# EAGLE design CrackberryPi_1.0.6 (EAGLE 7.2.0)
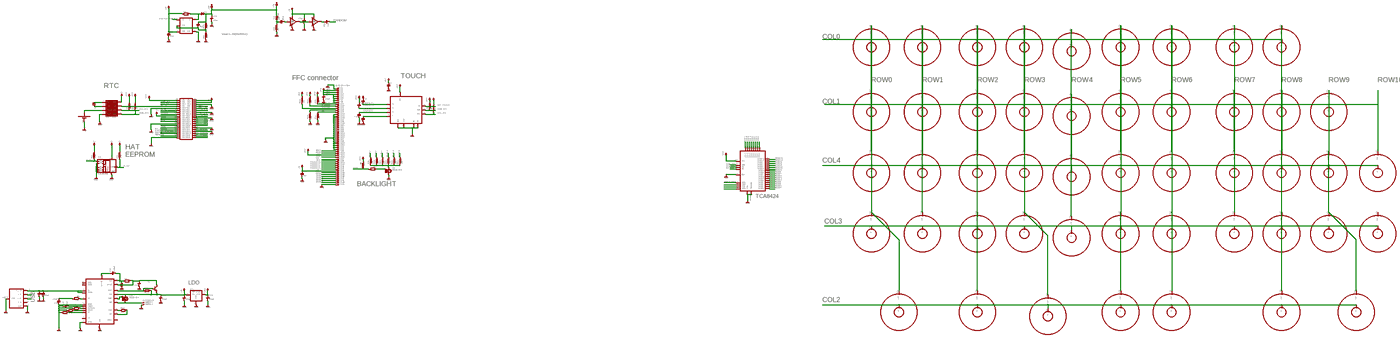
[diagram p0: schematic, sheet 1, overview]
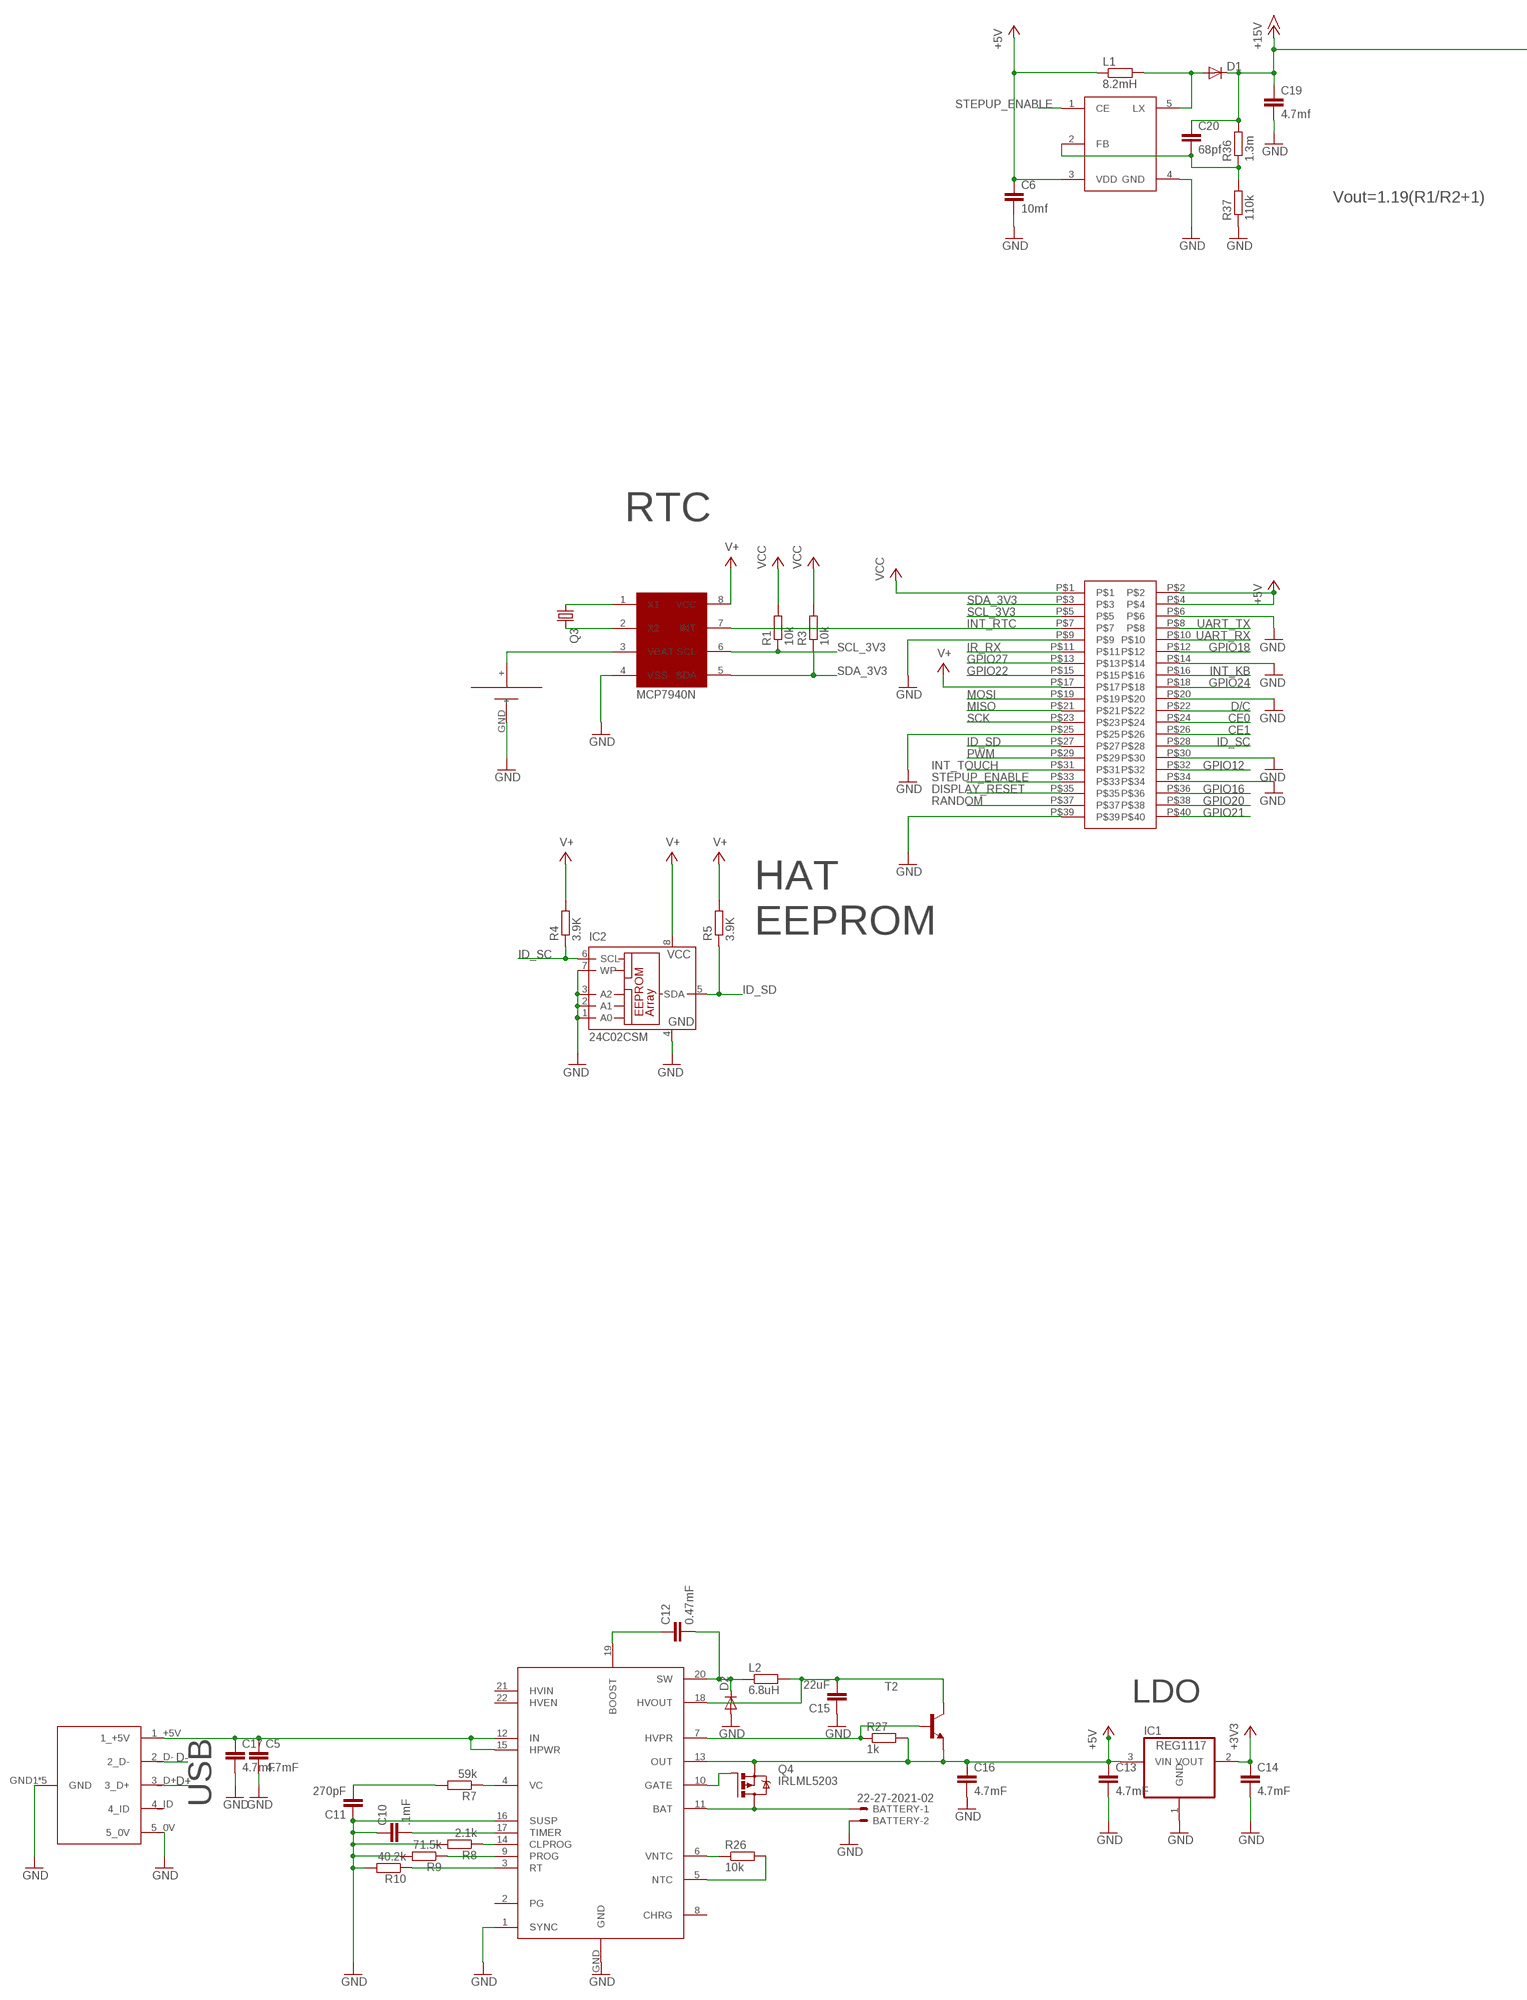
[diagram p1: schematic, sheet 1, part 1 of 4]
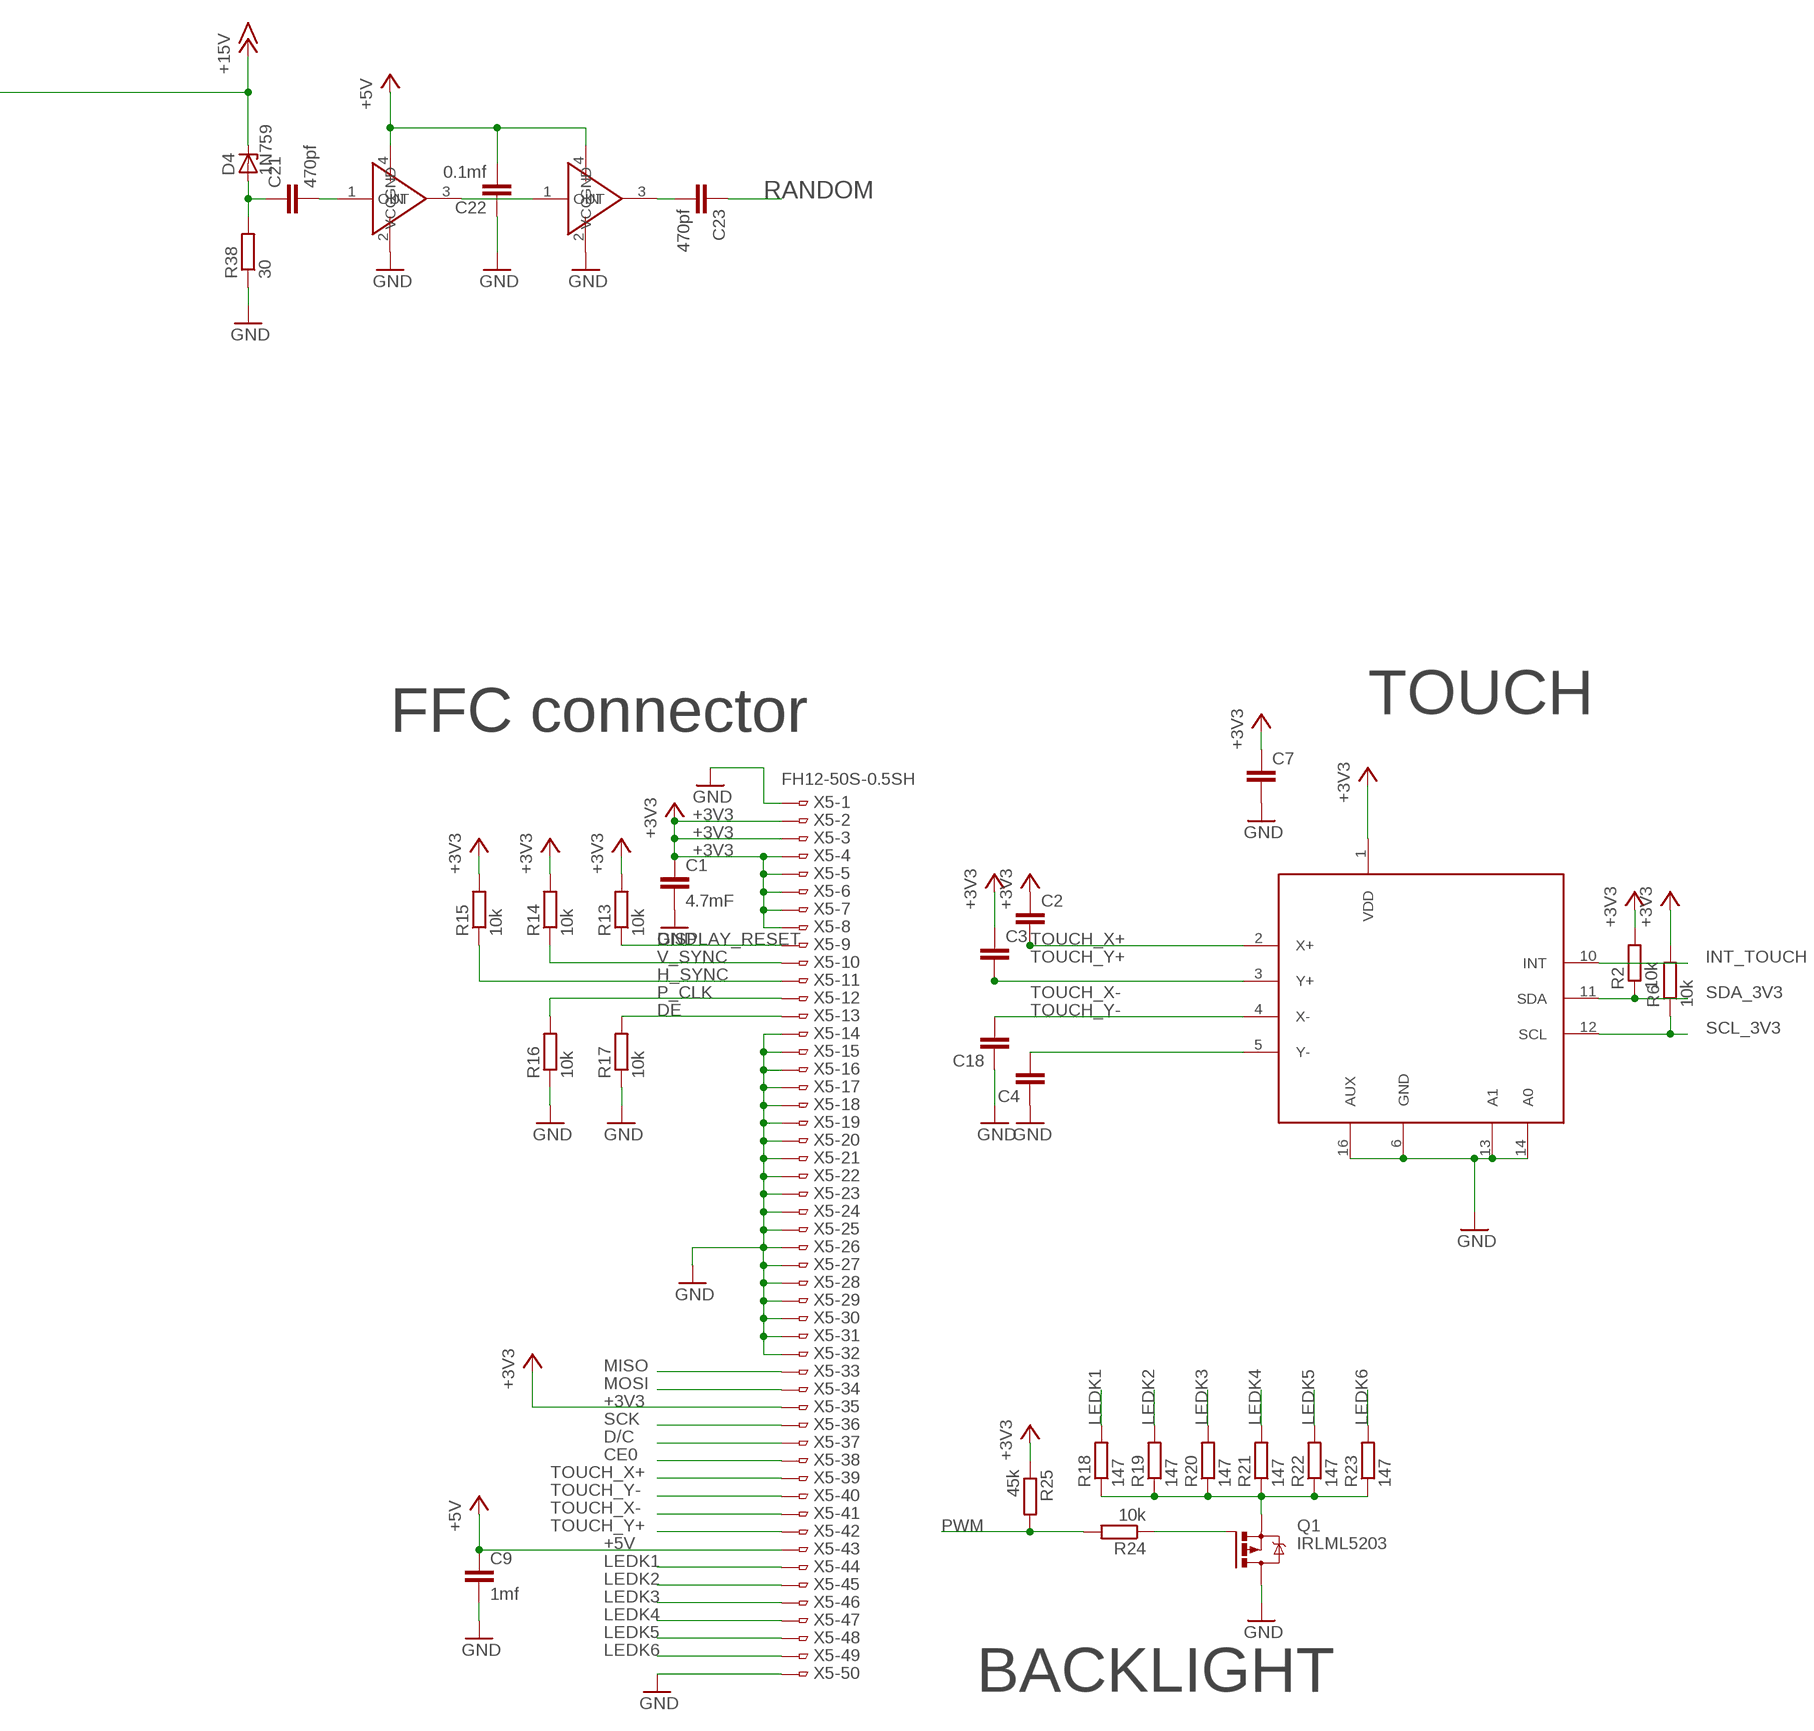
[diagram p2: schematic, sheet 1, part 2 of 4]
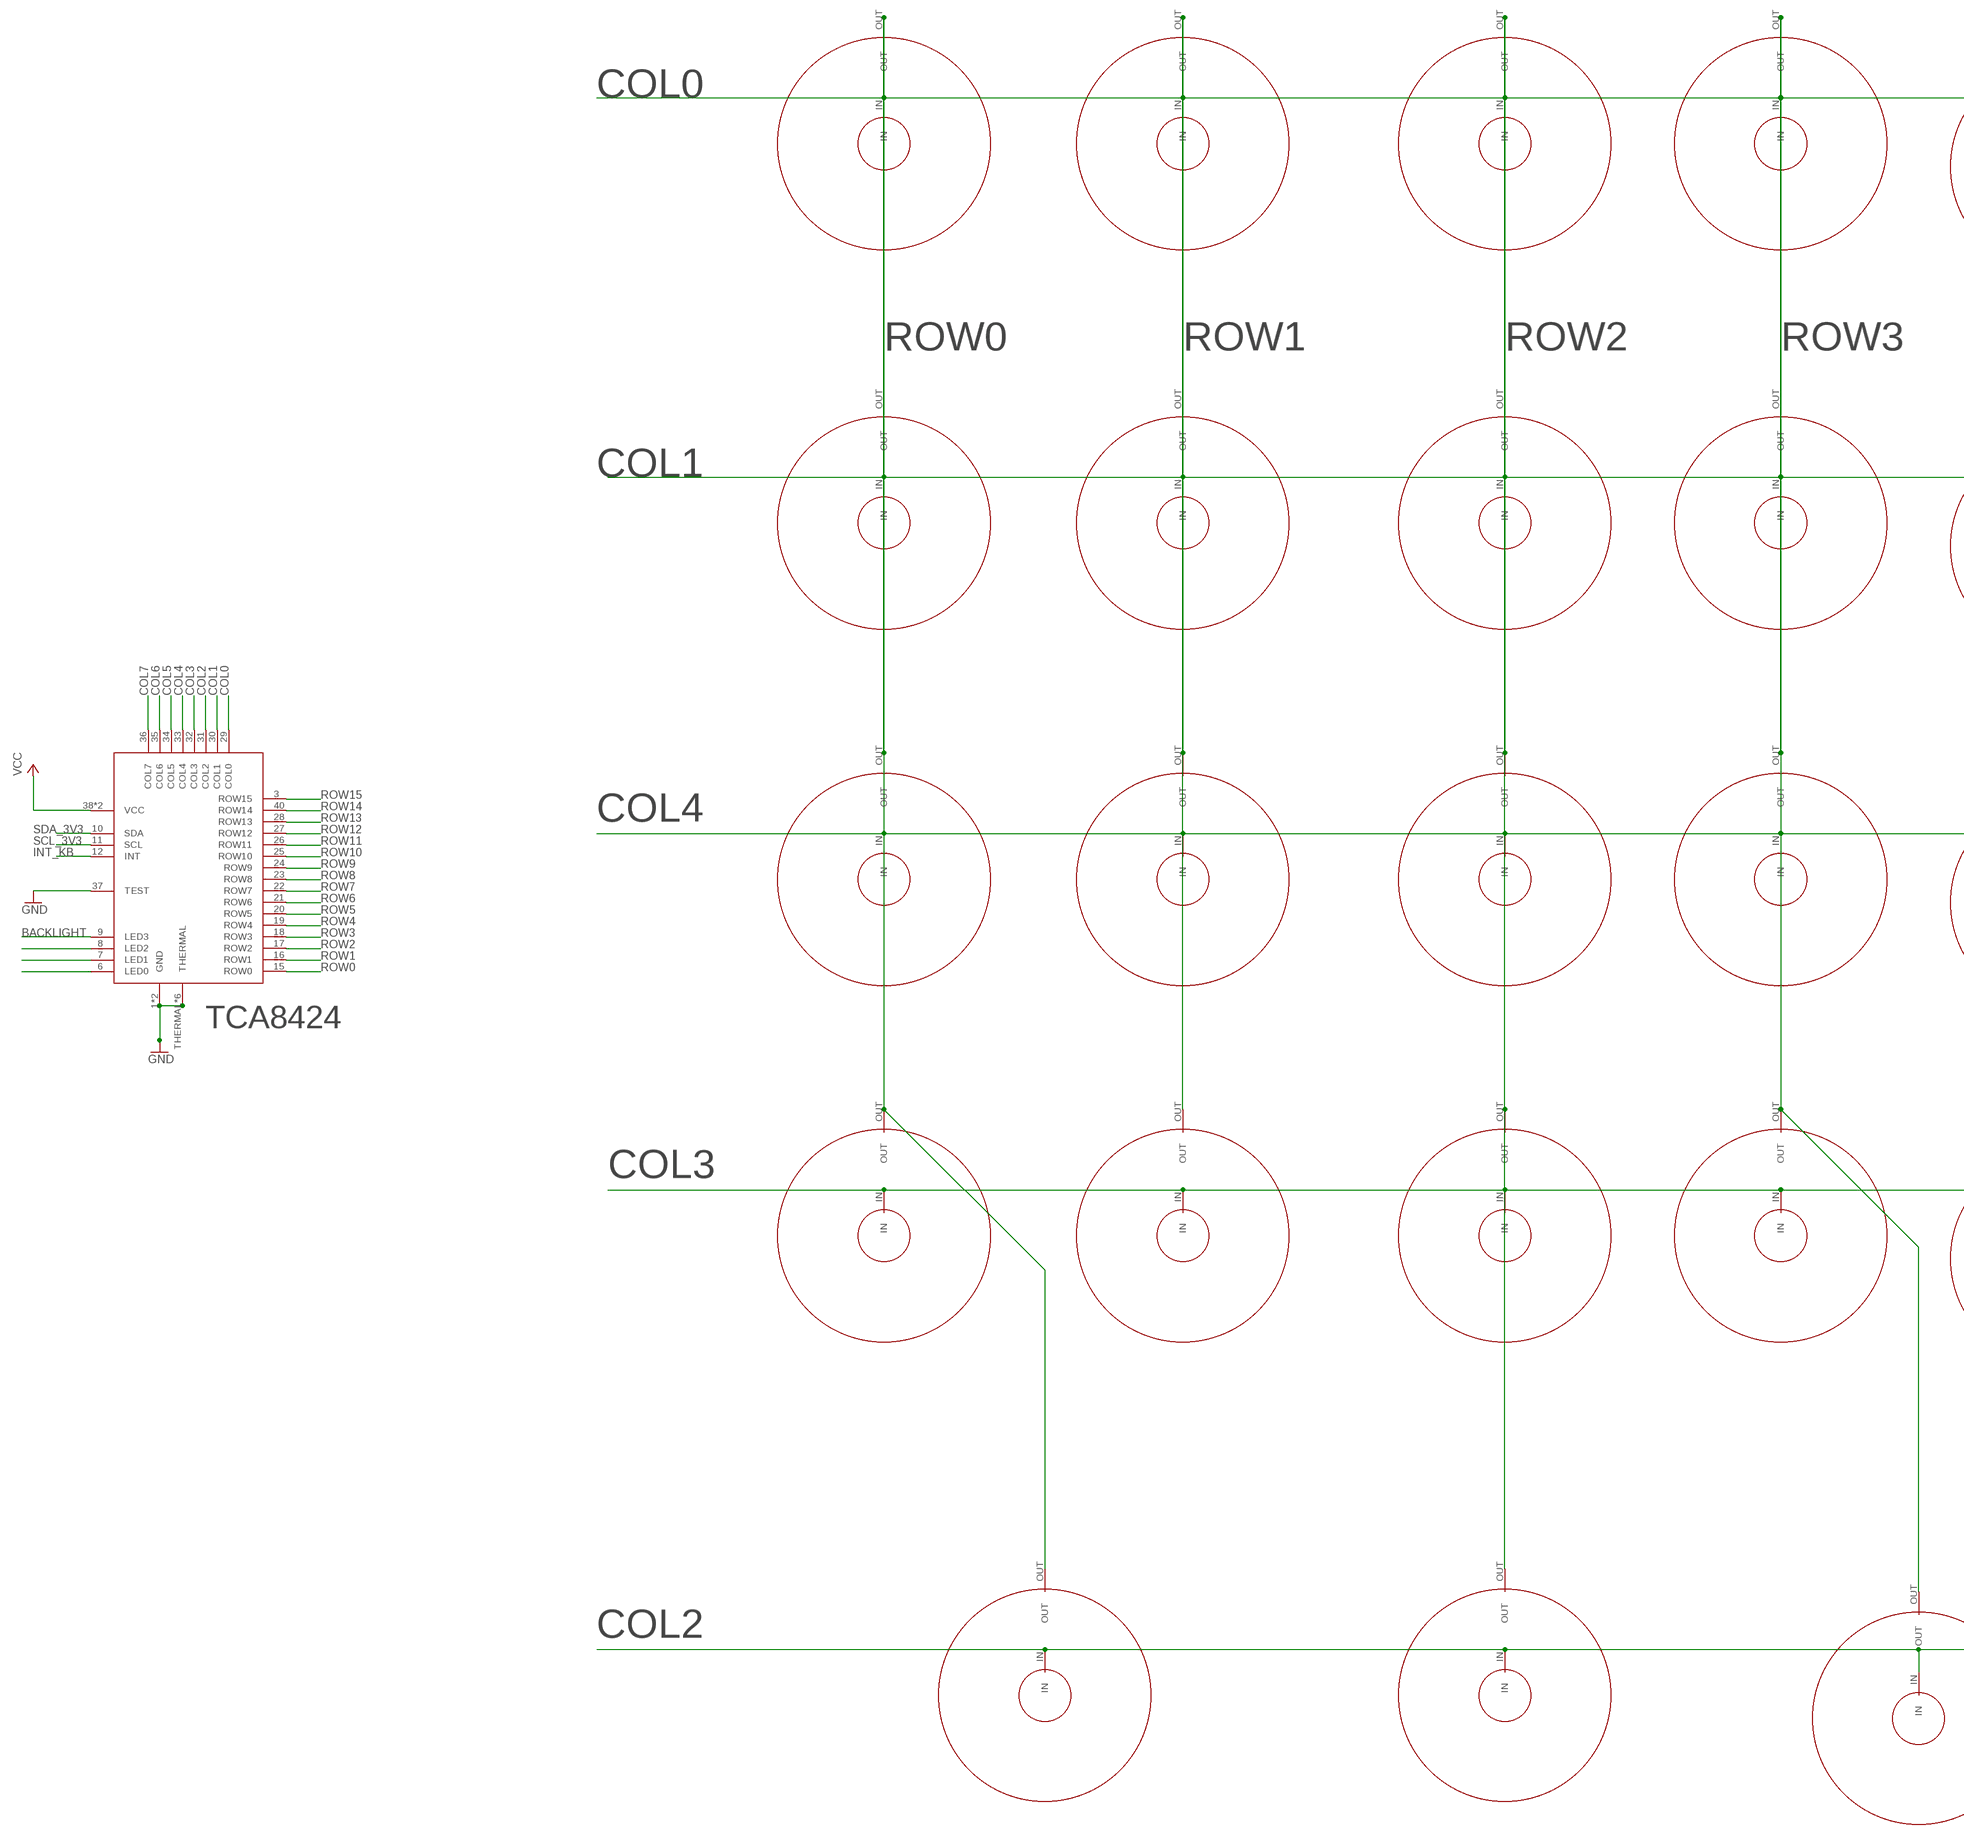
[diagram p3: schematic, sheet 1, part 3 of 4]
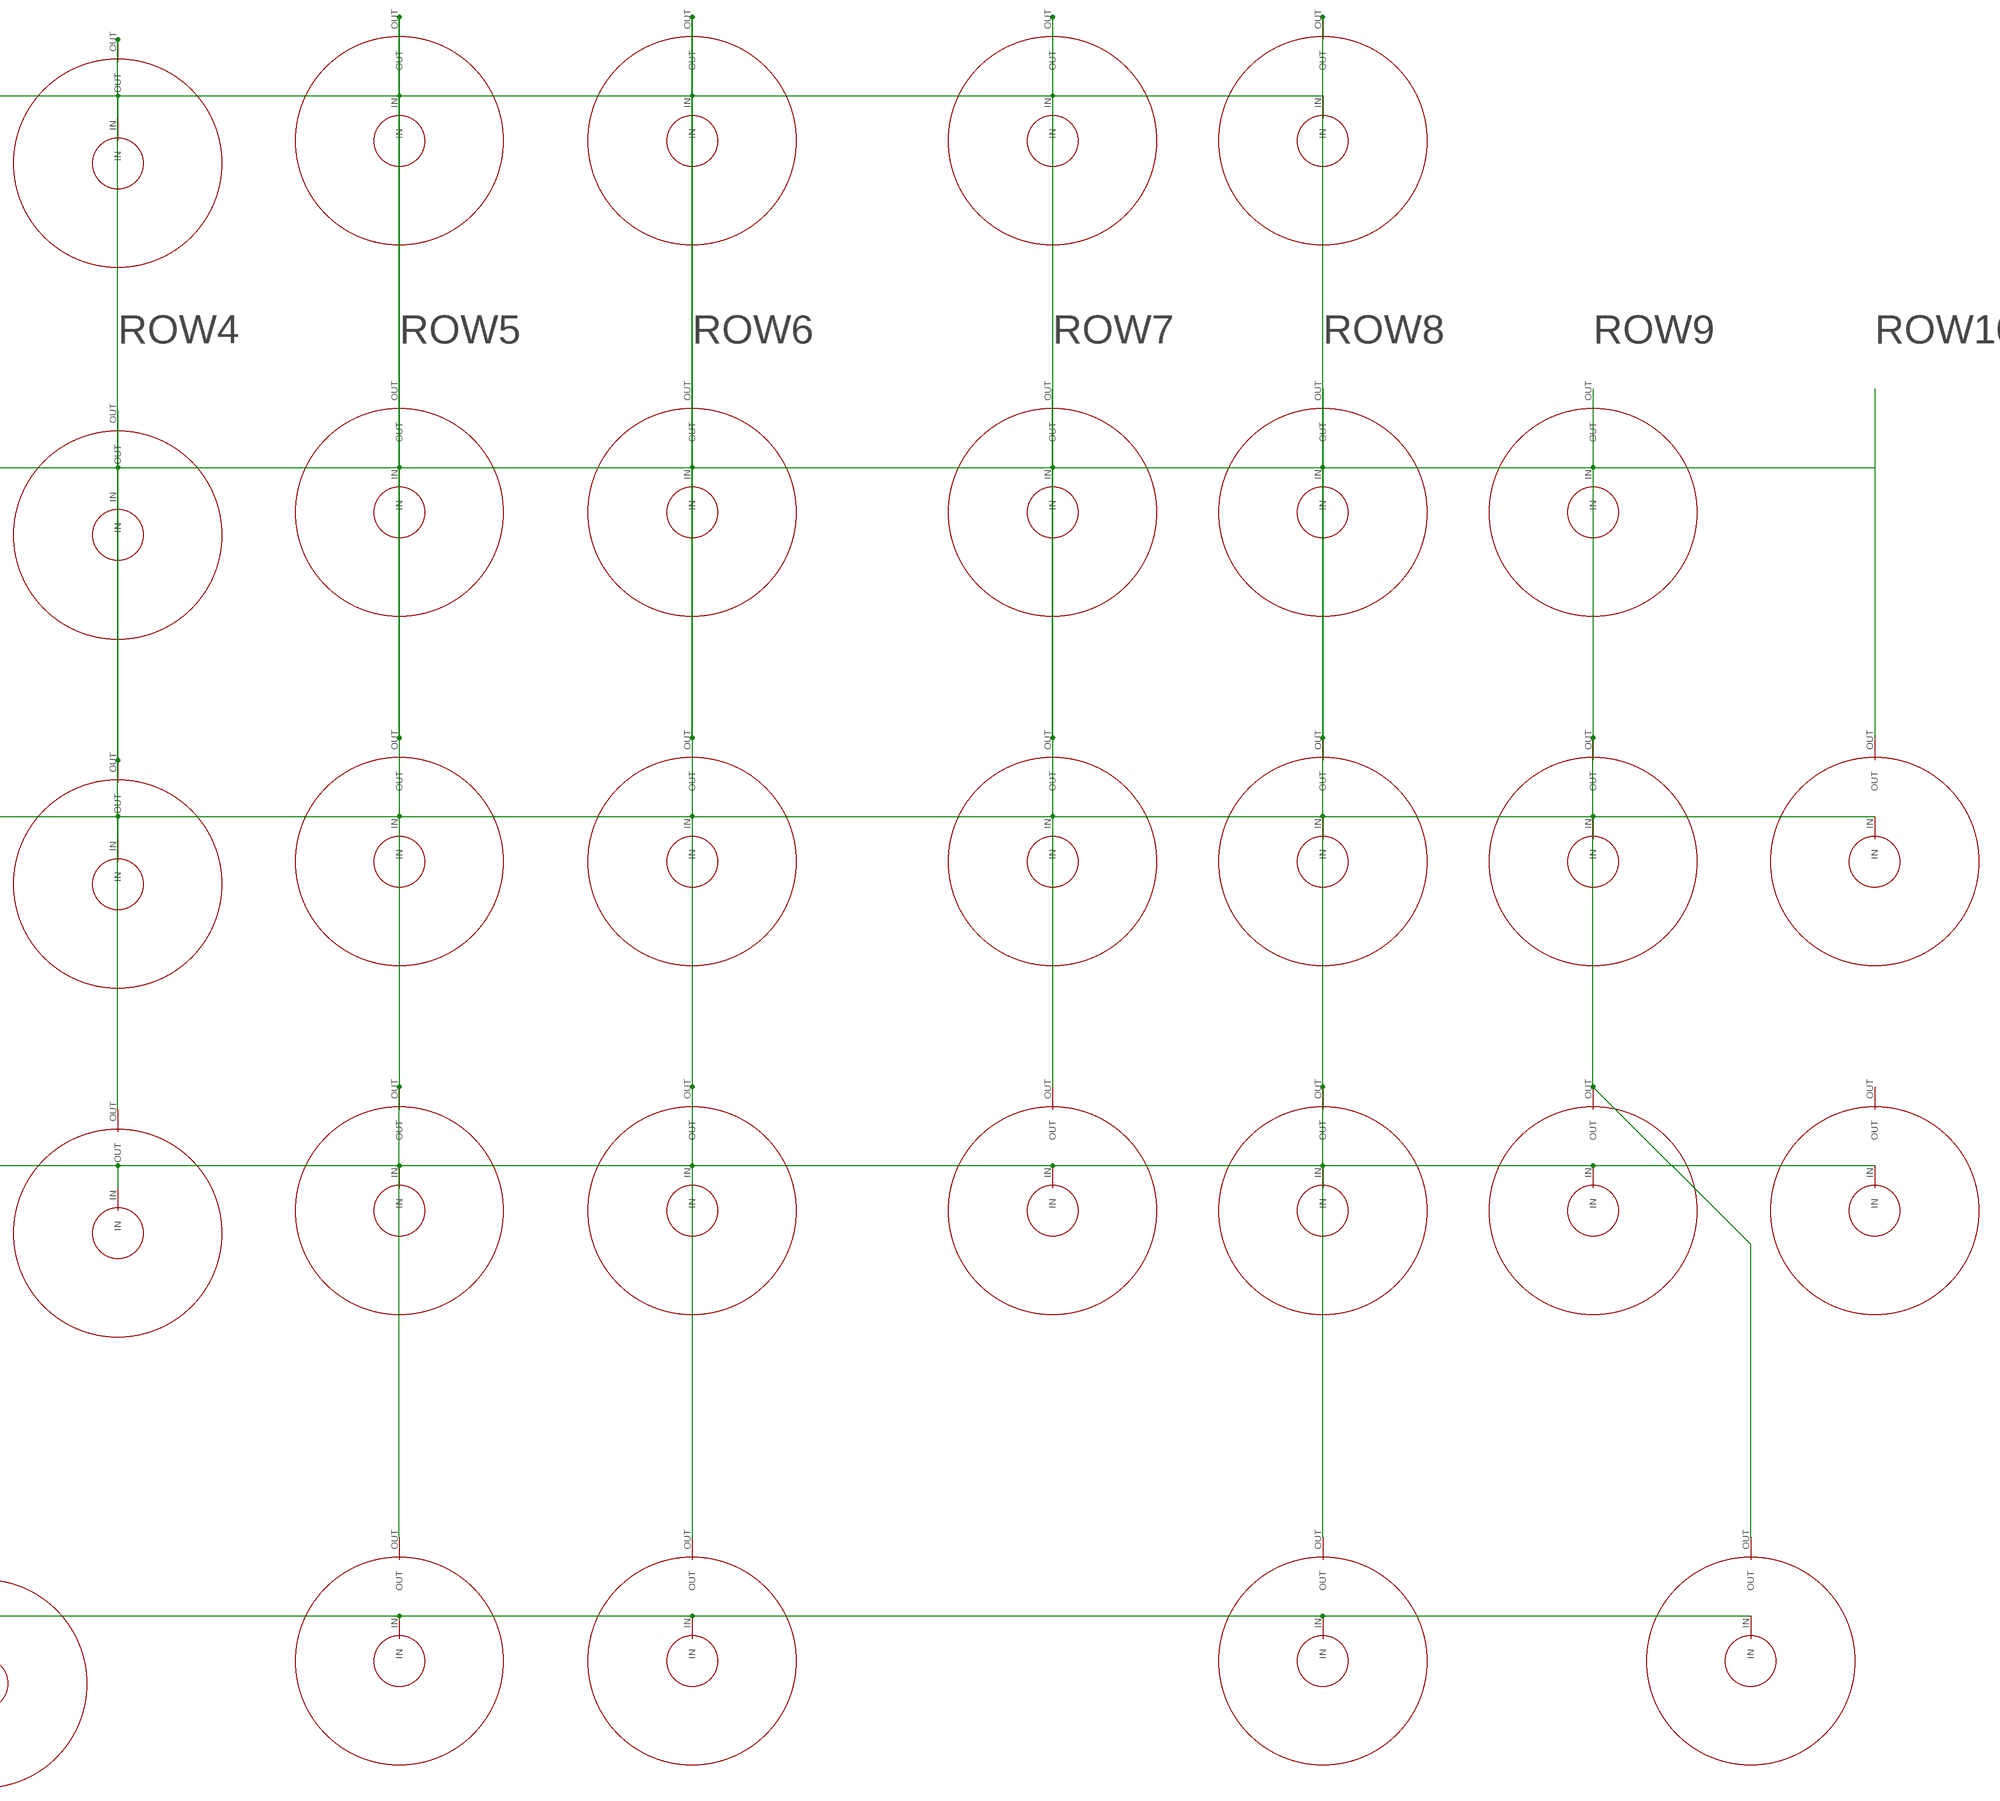
[diagram p4: schematic, sheet 1, part 4 of 4]

## Parts
1  DOME  [4MM]
2  DOME  [4MM]
3  DOME  [4MM]
4  DOME  [4MM]
5  DOME  [4MM]
6  DOME  [4MM]
7  DOME  [4MM]
8  DOME  [4MM]
9  DOME  [4MM]
!  DOME  [4MM]
(  DOME  [4MM]
)  DOME  [4MM]
,  DOME  [4MM]
.  DOME  [4MM]
?  DOME  [4MM]
@  DOME  [4MM]
A  DOME  [4MM]
B  DOME  [4MM]
BATTERY  22-27-2021-02  [6410-02]
C  DOME  [4MM]
C1  4.7mF  C-EUC0603  [C0603]
C2  C-EUC0603  [C0603]
C3  C-EUC0603  [C0603]
C4  C-EUC0603  [C0603]
C5  4.7mF  C-EUC0603  [C0603]
C6  10mf  C-EUC0603  [C0603]
C7  C-EUC0603  [C0603]
C9  1mf  C-EUC0603  [C0603]
C10  .1mF  C-EUC0603  [C0603]
C11  270pF  C-EUC0603  [C0603]
C12  0.47mF  C-EUC0603  [C0603]
C13  4.7mF  C-EUC0603  [C0603]
C14  4.7mF  C-EUC0603  [C0603]
C15  22uF  C-EUC1206  [C1206]
C16  4.7mF  C-EUC0603  [C0603]
C17  4.7mF  C-EUC0603  [C0603]
C18  C-EUC0603  [C0603]
C19  4.7mf  C-EUC0603  [C0603]
C20  68pf  C-EUC0603  [C0603]
C21  470pf  C-EUC0603  [C0603]
C22  0.1mf  C-EUC0603  [C0603]
C23  470pf  C-EUC0603  [C0603]
D  DOME  [4MM]
D1  DIODE-SOD123  [SOD123]
D2  DIODE-SOD123  [SOD123]
D4  1N759  ZENER-DIODESOD80C  [SOD80C]
E  DOME  [4MM]
F  DOME  [4MM]
FN-RIGHT  DOME  [4MM]
G  DOME  [4MM]
H  DOME  [4MM]
I  DOME  [4MM]
IC1  REG1117  [SOT223]
IC2  24C02CSM  [SO-08M]
J  DOME  [4MM]
K  DOME  [4MM]
L  DOME  [4MM]
L1  8.2mH  R-EU_R0805  [R0805]
L2  6.8uH  R-EU_R2010  [R2010]
M  DOME  [4MM]
N  DOME  [4MM]
O  DOME  [4MM]
P  DOME  [4MM]
Q  DOME  [4MM]
Q1  IRLML5203  [MICRO3]
Q3  CRYSTALMM20SS  [MM20SS]
Q4  IRLML5203  [MICRO3]
R  DOME  [4MM]
R1  10k  R-EU_R0603  [R0603]
R2  10k  R-EU_R0603  [R0603]
R3  10k  R-EU_R0603  [R0603]
R4  3.9K  R-EU_R0603  [R0603]
R5  3.9K  R-EU_R0603  [R0603]
R6  10k  R-EU_R0603  [R0603]
R7  59k  R-EU_R0603  [R0603]
R8  2.1k  R-EU_R0603  [R0603]
R9  71.5k  R-EU_R0603  [R0603]
R10  40.2k  R-EU_R0603  [R0603]
R13  10k  R-EU_R0603  [R0603]
R14  10k  R-EU_R0603  [R0603]
R15  10k  R-EU_R0603  [R0603]
R16  10k  R-EU_R0603  [R0603]
R17  10k  R-EU_R0603  [R0603]
R18  147  R-EU_R0603  [R0603]
R19  147  R-EU_R0603  [R0603]
R20  147  R-EU_R0603  [R0603]
R21  147  R-EU_R0603  [R0603]
R22  147  R-EU_R0603  [R0603]
R23  147  R-EU_R0603  [R0603]
R24  10k  R-EU_R0603  [R0603]
R25  45k  R-EU_R0603  [R0603]
R26  10k  R-EU_R0603  [R0603]
R27  1k  R-EU_R0603  [R0603]
R36  1.3m  R-EU_R0603  [R0603]
R37  110k  R-EU_R0603  [R0603]
R38  30  R-EU_R0603  [R0603]
S  DOME  [4MM]
SHIFT-RIGHT  DOME  [4MM]
SHILFT-LEFT  DOME  [4MM]
SPACE1  DOME  [4MM]
SPACE2  DOME  [4MM]
SPACE3  DOME  [4MM]
T  DOME  [4MM]
T2  -NPN-SOT23-EBC  [SOT23-EBC]
U  DOME  [4MM]
U$1  LTC4090  [DFN22]
U$2  NCP1406  [SOT23-5L]
U$3  MAX2650  [SOT143-W]
U$4  CR1216  [CR1216]
U$5  MCP7940N  [SO08]
U$6  TSC2007  [TSSOP16]
U$7  TCA8424  [QFN40]
U$9  MICRO_USB  [MICRO_USB]
U$10  MAX2650  [SOT143-W]
U$11  HEADER  [20X2]
V  DOME  [4MM]
W  DOME  [4MM]
X  DOME  [4MM]
X5  FH12-50S-0.5SH  [FH12-50S-0.5SH]
Y  DOME  [4MM]
Z  DOME  [4MM]

## Nets
+3V3: C1.1 C2.1 C3.1 C7.1 C14.1 IC1.2(VOUT) R2.2 R6.2 R13.2 R14.2 R15.2 R25.1 U$6.1(VDD) X5.2 X5.3 X5.4 X5.5 X5.6 X5.7 X5.8 X5.35
+5V: C6.1 C9.1 C13.1 C16.1 C22.2 IC1.3(VIN) L1.1 Q4.2(S) R27.2 T2.E U$1.13(OUT) U$2.3(VDD) U$3.4(VCC) U$10.4(VCC) U$11.P$2 U$11.P$4 X5.43
+15V: C19.1 C20.1 D1.C D4.C R36.2
BACKLIGHT: U$7.9(LED3)
BAT: BATTERY.1 Q4.3(D) U$1.11(BAT)
BOOST: C12.1 U$1.19(BOOST)
CE0: U$11.P$24 X5.38
CE1: U$11.P$26
COL0: 1.IN 2.IN 3.IN 4.IN 5.IN 6.IN 7.IN 8.IN 9.IN U$7.29(COL0)
COL1: E.IN I.IN O.IN P.IN Q.IN R.IN T.IN U$7.30(COL1) U.IN W.IN Y.IN
COL2: @.IN FN-RIGHT.IN SHIFT-RIGHT.IN SHILFT-LEFT.IN SPACE1.IN SPACE2.IN SPACE3.IN U$7.31(COL2)
COL3: !.IN ,.IN ..IN ?.IN B.IN C.IN M.IN N.IN U$7.32(COL3) V.IN X.IN Z.IN
COL4: (.IN ).IN A.IN D.IN F.IN G.IN H.IN J.IN K.IN L.IN S.IN U$7.33(COL4)
COL5: U$7.34(COL5)
COL6: U$7.35(COL6)
COL7: U$7.36(COL7)
D+: U$9.3_D+
D-: U$9.2_D-
D/C: U$11.P$22 X5.37
DE: R17.2 X5.13
DISPLAY_RESET: R13.1 U$11.P$35 X5.9
FB: C20.2 R36.1 R37.2 U$2.2(FB)
GND: BATTERY.2 C1.2 C4.1 C5.2 C6.2 C7.2 C9.2 C10.1 C11.1 C13.2 C14.2 C15.1 C16.2 C17.2 C18.1 C19.2 C22.1 D2.A IC1.1(GND) IC2.1(A0) IC2.2(A1) IC2.3(A2) IC2.4(GND) IC2.7(WP) Q1.3(D) R8.2 R9.2 R10.2 R16.1 R17.1 R37.1 R38.1 U$1.1(SYNC) U$1.16(SUSP) U$1.GND U$2.4(GND) U$3.2(GND) U$4.GND(-) U$5.4(VSS) U$6.6(GND) U$6.13(A1) U$6.14(A0) U$6.16(AUX) U$7.1(GND) U$7.4(GND) U$7.37(TEST) U$7.THERMAL U$7.VIA1(THERMAL) U$7.VIA2(THERMAL) U$7.VIA3(THERMAL) U$7.VIA4(THERMAL) U$7.VIA5(THERMAL) U$9.5_0V U$9.GND1(GND) U$9.GND2(GND) U$9.GND5(GND) U$9.P$1(GND) U$9.P$7(GND) U$10.2(GND) U$11.P$6 U$11.P$9 U$11.P$14 U$11.P$20 U$11.P$25 U$11.P$30 U$11.P$34 U$11.P$39 X5.1 X5.14 X5.15 X5.16 X5.17 X5.18 X5.19 X5.20 X5.21 X5.22 X5.23 X5.24 X5.25 X5.26 X5.27 X5.28 X5.29 X5.30 X5.31 X5.32 X5.50
GPIO12: U$11.P$32
GPIO16: U$11.P$36
GPIO18: U$11.P$12
GPIO20: U$11.P$38
GPIO21: U$11.P$40
GPIO22: U$11.P$15
GPIO24: U$11.P$18
GPIO27: U$11.P$13
H_SYNC: R15.1 X5.11
HVOUT: C15.2 L2.2 T2.C U$1.18(HVOUT)
HVPR: R27.1 T2.B U$1.7(HVPR)
ID_SC: IC2.6(SCL) R4.1 U$11.P$28
ID_SD: IC2.5(SDA) R5.1 U$11.P$27
IN: C5.1 C17.1 U$1.12(IN) U$1.15(HPWR) U$9.1_+5V
IN_1: C21.2 U$3.1(IN)
INT_KB: U$7.12(INT) U$11.P$16
INT_RTC: U$5.7(INT) U$11.P$7
INT_TOUCH: U$6.10(INT) U$11.P$31
IR_RX: U$11.P$11
LEDK1: R18.2 X5.44
LEDK2: R19.2 X5.45
LEDK3: R20.2 X5.46
LEDK4: R21.2 X5.47
LEDK5: R22.2 X5.48
LEDK6: R23.2 X5.49
LX: D1.A L1.2 U$2.5(LX)
MISO: U$11.P$21 X5.33
MOSI: U$11.P$19 X5.34
N$3: R9.1 U$1.9(PROG)
N$4: R10.1 U$1.3(RT)
N$5: R8.1 U$1.14(CLPROG)
N$6: R7.1 U$1.4(VC)
N$7: C10.2 U$1.17(TIMER)
N$8: C11.2 R7.2
N$10: U$7.6(LED0)
N$11: Q3.1 U$5.1(X1)
N$12: Q1.2(S) R18.1 R19.1 R20.1 R21.1 R22.1 R23.1
N$13: Q3.4 U$5.2(X2)
N$14: U$7.7(LED1)
N$16: C21.1 D4.A R38.2
N$18: U$7.8(LED2)
N$20: Q1.1(G) R24.1
N$21: R26.1 U$1.6(VNTC)
N$27: R26.2 U$1.5(NTC)
N$33: Q4.1(G) U$1.10(GATE)
OUT1_IN2: U$3.3(OUT) U$10.1(IN)
OUT2: C23.2 U$10.3(OUT)
P_CLK: R16.2 X5.12
PWM: R24.2 R25.2 U$11.P$29
RANDOM: C23.1 U$11.P$37
ROW0: 1.OUT A.OUT Q.OUT SHILFT-LEFT.OUT U$7.15(ROW0) Z.OUT
ROW1: 2.OUT S.OUT U$7.16(ROW1) W.OUT X.OUT
ROW2: 3.OUT C.OUT D.OUT E.OUT SPACE1.OUT U$7.17(ROW2)
ROW3: 4.OUT F.OUT R.OUT SPACE2.OUT U$7.18(ROW3) V.OUT
ROW4: 5.OUT B.OUT G.OUT T.OUT U$7.19(ROW4)
ROW5: 6.OUT H.OUT N.OUT SPACE3.OUT U$7.20(ROW5) Y.OUT
ROW6: 7.OUT J.OUT M.OUT SHIFT-RIGHT.OUT U$7.21(ROW6) U.OUT
ROW7: 8.OUT ?.OUT I.OUT K.OUT U$7.22(ROW7)
ROW8: 9.OUT !.OUT @.OUT L.OUT O.OUT U$7.23(ROW8)
ROW9: (.OUT ,.OUT FN-RIGHT.OUT P.OUT U$7.24(ROW9)
ROW10: ).OUT U$7.25(ROW10)
ROW11: U$7.26(ROW11)
ROW12: U$7.27(ROW12)
ROW13: U$7.28(ROW13)
ROW14: U$7.40(ROW14)
ROW15: U$7.3(ROW15)
SCK: U$11.P$23 X5.36
SCL_3V3: R1.1 R6.1 U$5.6(SCL) U$6.12(SCL) U$7.11(SCL) U$11.P$5
SDA_3V3: R2.1 R3.1 U$5.5(SDA) U$6.11(SDA) U$7.10(SDA) U$11.P$3
STEPUP_ENABLE: U$2.1(CE) U$11.P$33
SW: C12.2 D2.C L2.1 U$1.20(SW)
TOUCH_X+: C2.2 U$6.2(X+) X5.39
TOUCH_X-: C18.2 U$6.4(X-) X5.41
TOUCH_Y+: C3.2 U$6.3(Y+) X5.42
TOUCH_Y-: C4.2 U$6.5(Y-) X5.40
UART_RX: U$11.P$10
UART_TX: U$11.P$8
V+: IC2.8(VCC) R4.2 R5.2 U$5.8(VCC) U$11.P$17
V_SYNC: R14.1 X5.10
VBAT+: U$4.+ U$5.3(VBAT)
VCC: R1.2 R3.2 U$7.38(VCC) U$7.39(VCC) U$11.P$1
Unconnected: ..OUT U$1.2(PG) U$1.8(CHRG) U$1.21(HVIN) U$1.22(HVEN) U$9.4_ID

## Notes on the sheet
- Vout=1.19(R1/R2+1)
- FFC connector | TOUCH
- RTC
- MCP7940N
- HAT
  EEPROM
- BACKLIGHT
- TCA8424
- LDO
- USB

## Library data of the parts
1-9 ! ( ) , . ? @ A B C D E F FN-RIGHT G H I J K L M N O P Q R S SHIFT-RIGHT SHILFT-LEFT SPACE1-SPACE3 T U V W X Y Z = DOME:DOME
BATTERY = con-molex:22-?-02: CONNECTOR wire to board 2.54 mm (.1 inch) pitch header; OC_FARNELL: unknown; OC_NEWARK: unknown
C1-C7 C9-C23 = rcl:C-EU: CAPACITOR, European symbol
D1 D2 = diode:DIODE-: DIODE
D4 = diode:ZENER-DIODE: Z-Diode
IC1 = burr-brown:REG1117: 800mA and 1A Low Dropout (LDO) Positive Regulator 1.8V, 2.5V, 2.85V, 3.3V, 5V, and Adj; MPN: REG1117; OC_FARNELL: 1097566; OC_NEWARK: 14P6981
IC2 = microchip:24C*: Serial EEPROM 1 K/2 K/4 K; MF: MICROCHIP; MPN: 24C02C-I/SN; OC_FARNELL: 1084339; OC_NEWARK: 96K4063
L1 L2 R1-R10 R13-R27 R36-R38 = rcl:R-EU_: RESISTOR, European symbol
Q1 Q4 = transistor-power:IRLML5203: HEXFET P-Channel Power MOSFET
Q3 = crystal:CRYSTAL: CRYSTAL; OC_FARNELL: unknown; OC_NEWARK: unknown
T2 = transistor:*-NPN-: NPN Transistror BF959 corrected 2008.03.06
U$1 = LTC4090:LTC4090
U$2 = ncp1406:NCP1406
U$3 U$10 = max2650:MAX2650
U$4 = cr1216:CR1216
U$5 = MCP7940N:MCP7940N
U$6 = tsc2046:TSC2007
U$7 = TCA8424:TCA8424
U$9 = MICRO_USB:MICRO_USB
U$11 = 20x2_cirqoid:HEADER
X5 = FCI_62684:FH12-50S-0.5S: 0.5mm Pitch Connectors For FPC/FFC Source: Data sheet <http://www.hirose.co.jp/cataloge_hp/e58605370.pdf>; MPN: FH12-50S-0.5SH(55); OC_FARNELL: 1324557; OC_NEWARK: 34M6181

## Board
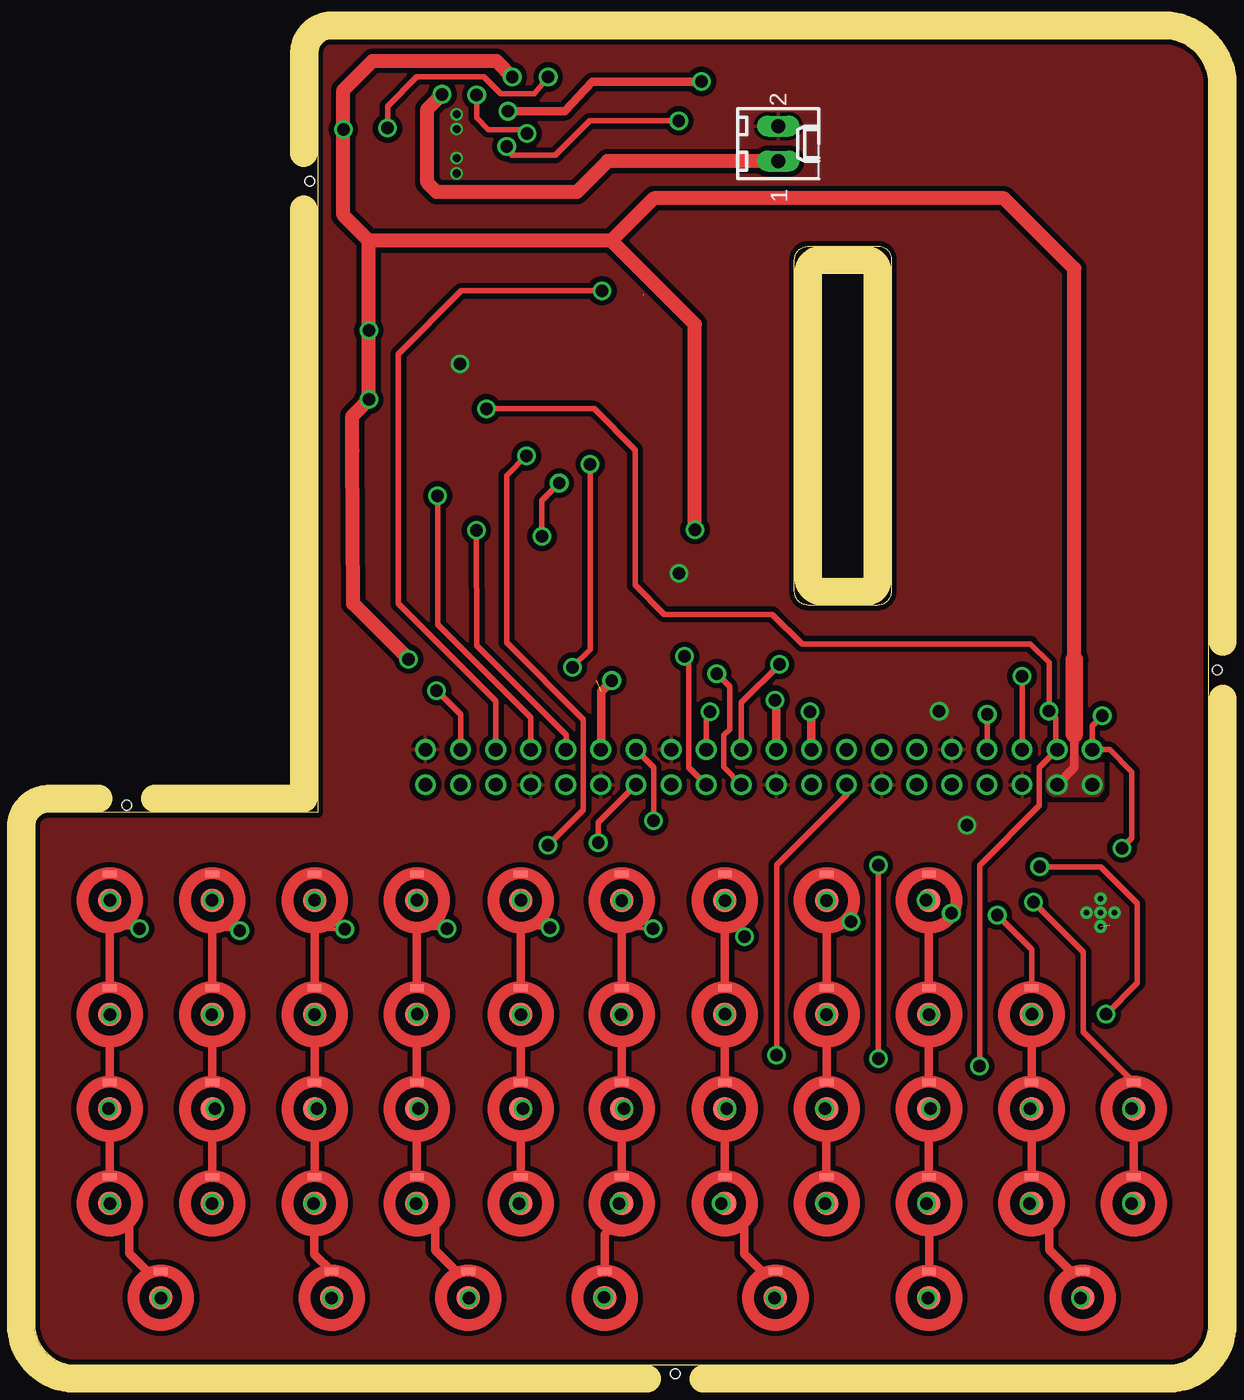
[diagram p5: board, top side]
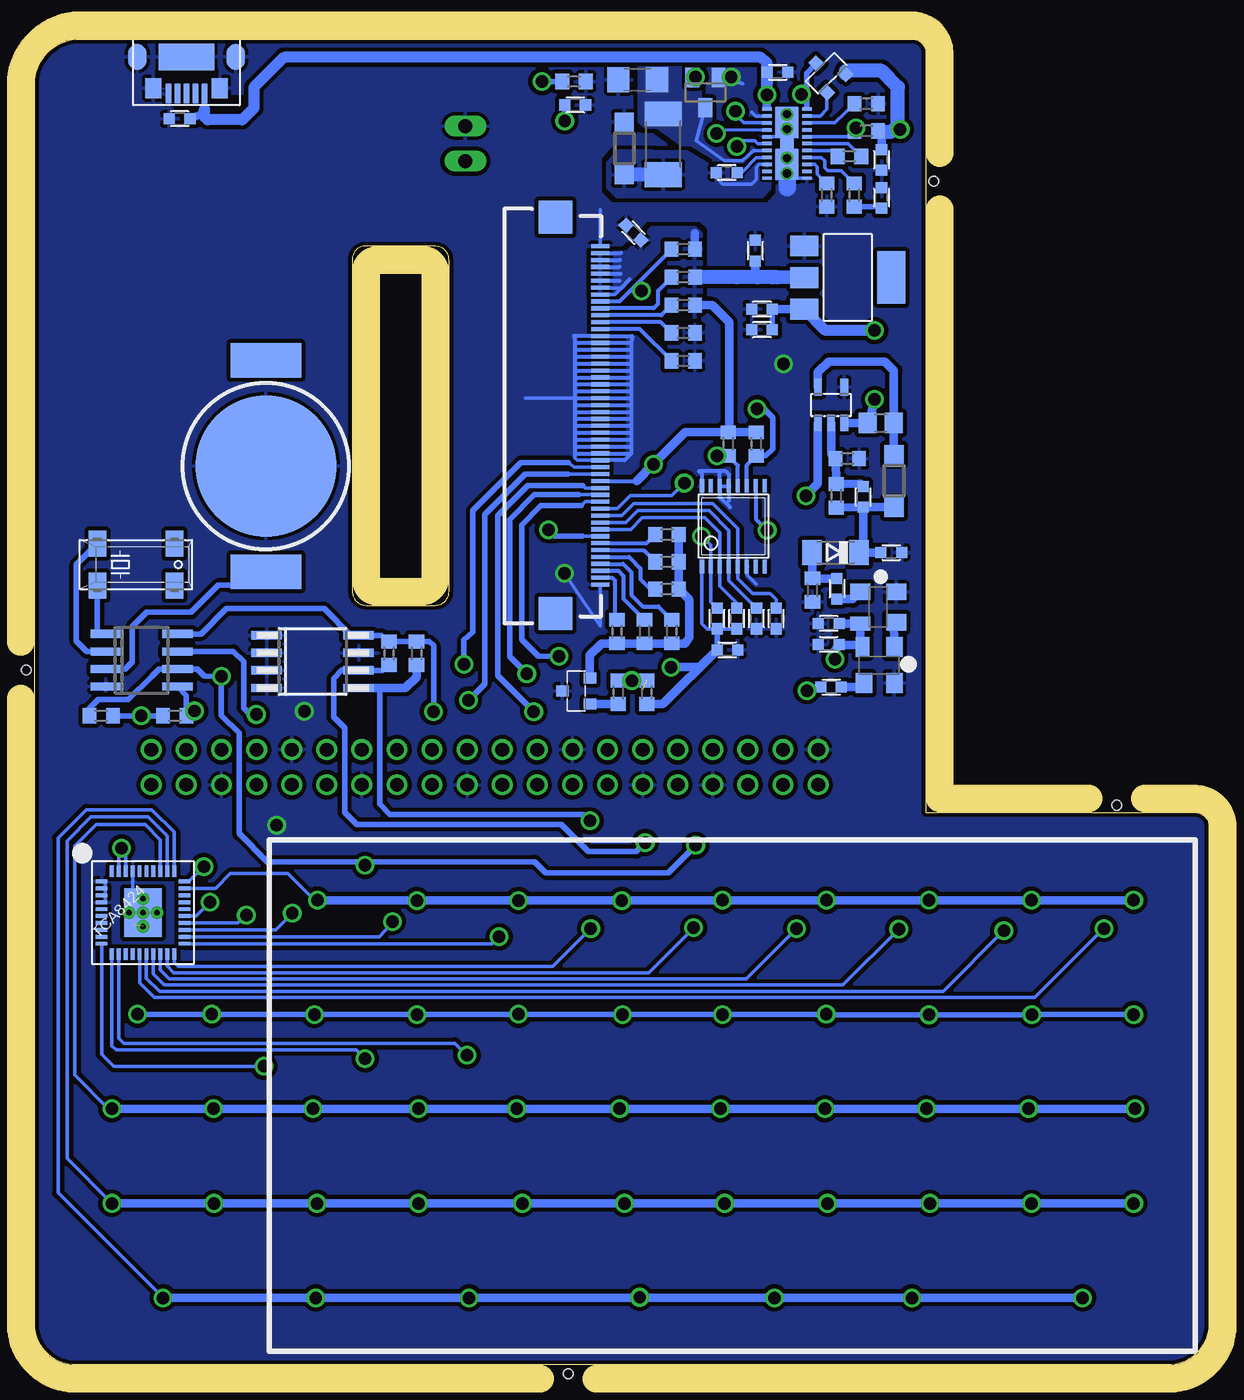
[diagram p6: board, bottom side, seen from below]

Size 85 x 96 mm. Coordinates in mm from the lower left corner, seen from the top.
Outline: 0,39 0,3 arc90 3,0 82,0 arc90 85,3 85,92.7 arc90 81.7,96 21.5,96 arc90 20.5,95 20.5,40 1,40 arc90 0,39
Outline: 56,81 61,81 arc-90 62,80.15 62,56 arc-90 61,55 56,55 arc-90 55,56 55,80 arc-90 56,81
Copper layers (1*16): Top 0.035mm / dielectric 1.5mm / Bottom 0.035mm
Design rules "SeeedStudio_2layer_DRU_no_angle_20140221": minimum track width 6mil, minimum drill 12mil, track to track 6mil, track to pad 6mil, pad to pad 6mil, via to via 6mil, smd to smd 0mil, copper to edge 10mil, drill to drill 10mil, minimum pad ring 10mil, minimum via ring 6mil, stop-mask expansion 2mil, vias tented up to drill 100mil, thermal gap 10mil
Holes 0.7 mm at 19.93,85.7 85.6,50.3 6.67,40.52 46.38,-0.62
bRestrict: area 42.5,73.2 to 45.4,73.3; area 42.5,72.7 to 45.4,72.8; area 42.5,72.2 to 45.4,72.3; area 42.5,71.7 to 45.4,71.8; area 42.5,71.2 to 45.4,71.3; area 42.5,70.7 to 45.4,70.8; area 42.5,70.2 to 45.4,70.3; area 42.5,69.7 to 45.4,69.8; area 42.5,69.2 to 45.4,69.3; area 42.5,68.7 to 45.4,68.8; area 42.5,68.2 to 45.4,68.3; area 42.5,67.7 to 45.4,67.8; 8 more areas
Milling: 24 lines

### Footprints (pad centres in the part's own frame; a part is rotated, then mirrored left to right if it is on the bottom)
4MM = smd 1.7 x 1.7: IN 0,0 | smd 1 x 0.5: OUT 0,1.9
6410-02 = drill 1.016 long: 1 1.27,0; 2 -1.27,0
C0603 = smd 0.8 x 0.8: 1 -0.75,0; 2 0.75,0
C1206 = smd 1.6 x 1.8: 1 -1.4,0; 2 1.4,0
SOD123 = smd 1.4 x 1.4: A 1.9,0; C -1.9,0
SOD80C = smd 1.4 x 1.8: A 1.7,0; C -1.7,0
SOT223 = smd 1.499 x 2.007: 1 -2.261,-3.15; 2 0.025,-3.15; 3 2.311,-3.15 | smd 3.81 x 2.007: 4 0,3.15
SO-08M = smd 0.6 x 2.2: 1 -1.905,-3.33; 2 -0.635,-3.33; 3 0.635,-3.33; 4 1.905,-3.33; 5 1.905,3.33; 6 0.635,3.33; 7 -0.635,3.33; 8 -1.905,3.33
R0805 = smd 1.3 x 1.5: 1 -0.95,0; 2 0.95,0
R2010 = smd 1.8 x 2.7: 1 -2.2,0; 2 2.2,0
MICRO3 = smd 0.8 x 0.9: 1 -0.95,-1; 2 0.95,-1; 3 0,1
MM20SS = smd 1.27 x 1.88: 1 -2.794,-1.524; 2 2.794,-1.524; 3 2.794,1.524; 4 -2.794,1.524
R0603 = smd 1 x 1.1: 1 -0.85,0; 2 0.85,0
SOT23-EBC = smd 1 x 1.4: B 0.95,-1.1; C 0,1.1; E -0.95,-1.1
DFN22 = smd 0.25 x 0.7: 1 -2.5,-1.45; 2 -2,-1.45; 3 -1.5,-1.45; 4 -1,-1.45; 5 -0.5,-1.45; 6 0,-1.45; 7 0.5,-1.45; 8 1,-1.45; 9 1.5,-1.45; 10 2,-1.45; 11 2.5,-1.45; 12 2.5,1.45; 13 2,1.45; 14 1.5,1.45; 15 1,1.45; 16 0.5,1.45; 17 0,1.45; 18 -0.5,1.45; 19 -1,1.45; 20 -1.5,1.45; 21 -2,1.45; 22 -2.5,1.45 | smd 2.2 x 1.65: GND 1.525,0; GND1 -1.5,0 | smd 0.9 x 0.9: P$1 0,0
SOT23-5L = smd 0.55 x 1.2: 1 -0.95,-1.3; 2 0,-1.3; 3 0.95,-1.3; 4 0.95,1.3; 5 -0.95,1.3
SOT143-W = smd 1.2 x 1.45: 1 -1.1,-1.3; 2 -1.1,1.3; 3 1.1,1.3 | smd 1 x 1.45: 4 1.2,-1.3
CR1216 = smd 2.5 x 5.1: + -7.65,0; P$2 7.65,0 | smd 10.2 x 10.2: GND 0,0
SO08 = smd 0.6 x 2.2: 1 -1.905,-2.6; 2 -0.635,-2.6; 3 0.635,-2.6; 4 1.905,-2.6; 5 1.905,2.6; 6 0.635,2.6; 7 -0.635,2.6; 8 -1.905,2.6
TSSOP16 = smd 0.305 x 0.991: 1 -2.275,-2.918; 2 -1.625,-2.918; 3 -0.975,-2.918; 4 -0.325,-2.918; 5 0.325,-2.918; 6 0.975,-2.918; 7 1.625,-2.918; 8 2.275,-2.918; 9 2.275,2.918; 10 1.625,2.918; 11 0.975,2.918; 12 0.325,2.918; 13 -0.325,2.918; 14 -0.975,2.918; 15 -1.625,2.918; 16 -2.275,2.918
QFN40 = smd 0.85 x 0.28: 1 -3,2.25; 2 -3,1.75; 3 -3,1.25; 4 -3,0.75; 5 -3,0.25; 6 -3,-0.25; 7 -3,-0.75; 8 -3,-1.25; 9 -3,-1.75; 10 -3,-2.25; 21 3,-2.25; 22 3,-1.75; 23 3,-1.25; 24 3,-0.75; 25 3,-0.25; 26 3,0.25; 27 3,0.75; 28 3,1.25; 29 3,1.75; 30 3,2.25 | smd 0.28 x 0.85: 11 -2.25,-3; 12 -1.75,-3; 13 -1.25,-3; 14 -0.75,-3; 15 -0.25,-3; 16 0.25,-3; 17 0.75,-3; 18 1.25,-3; 19 1.75,-3; 20 2.25,-3; 31 2.25,3; 32 1.75,3; 33 1.25,3; 34 0.75,3; 35 0.25,3; 36 -0.25,3; 37 -0.75,3; 38 -1.25,3; 39 -1.75,3; 40 -2.25,3 | smd 2.7 x 3.5: P$2 0,0 | smd 1 x 1.5: P$11 -0.65,0.9; P$12 0.65,0.9; P$13 0.65,-0.9; THERMAL -0.65,-0.9 | drill 0.4 pad 0.406: VIA1 0,1; VIA2 -1,0; VIA3 0,0; VIA4 1,0; VIA5 0,-1
MICRO_USB = smd 0.4 x 1.4: 1_+5V -1.3,2.65; 2_D- -0.65,2.65; 3_D+ 0,2.65; 4_ID 0.65,2.65; 5_0V 1.3,2.65 | smd 4 x 1.9: GND1 0,0 | smd 1.35 x 1.9: GND2 -3.55,0; GND5 3.55,0 | smd 1.15 x 1.45: P$1 -2.4,2.25; P$7 2.4,2.25
20X2 = drill 1: P$1 0,0; P$2 0,2.54; P$3 2.54,0; P$4 2.54,2.54; P$5 5.08,0; P$6 5.08,2.54; P$7 7.62,0; P$8 7.62,2.54; P$9 10.16,0; P$10 10.16,2.54; P$11 12.7,0; P$12 12.7,2.54; P$13 15.24,0; P$14 15.24,2.54; P$15 17.78,0; P$16 17.78,2.54; P$17 20.32,0; P$18 20.32,2.54; P$19 22.86,0; P$20 22.86,2.54; P$21 25.4,0; P$22 25.4,2.54; P$23 27.94,0; P$24 27.94,2.54; P$25 30.48,0; P$26 30.48,2.54; P$27 33.02,0; P$28 33.02,2.54; P$29 35.56,0; P$30 35.56,2.54; P$31 38.1,0; P$32 38.1,2.54; P$33 40.64,0; P$34 40.64,2.54; P$35 43.18,0; P$36 43.18,2.54; P$37 45.72,0; P$38 45.72,2.54; P$39 48.26,0; P$40 48.26,2.54
FH12-50S-0.5SH = smd 1.3 x 0.3: 1 3.95,27.8; 2 3.95,27.3; 3 3.95,26.8; 4 3.95,26.3; 5 3.95,25.8; 6 3.95,25.3; 7 3.95,24.8; 8 3.95,24.3; 9 3.95,23.8; 10 3.95,23.3; 11 3.95,22.8; 12 3.95,22.3; 13 3.95,21.8; 14 3.95,21.3; 15 3.95,20.8; 16 3.95,20.3; 17 3.95,19.8; 18 3.95,19.3; 19 3.95,18.8; 20 3.95,18.3; 21 3.95,17.8; 22 3.95,17.3; 23 3.95,16.8; 24 3.95,16.3; 25 3.95,15.8; 26 3.95,15.3; 27 3.95,14.8; 28 3.95,14.3; 29 3.95,13.8; 30 3.95,13.3; 31 3.95,12.8; 32 3.95,12.3; 33 3.95,11.8; 34 3.95,11.3; 35 3.95,10.8; 36 3.95,10.3; 37 3.95,9.8; 38 3.95,9.3; 39 3.95,8.8; 40 3.95,8.3; 41 3.95,7.8; 42 3.95,7.3; 43 3.95,6.8; 44 3.95,6.3; 45 3.95,5.8; 46 3.95,5.3; 47 3.95,4.8; 48 3.95,4.3; 49 3.95,3.8; 50 3.95,3.3 | smd 2.4 x 2.4: P$1 0.7,1.2; P$2 0.7,29.9

### Placement (x,y rotation side)
1  5.43,33.63 0 top
2  12.86,33.63 0 top
3  20.27,33.63 0 top
4  27.68,33.63 0 top
5  35.2,33.63 0 top
6  42.51,33.63 0 top
7  49.97,33.63 0 top
8  57.33,33.63 0 top
9  64.73,33.63 0 top
!  64.73,11.71 0 top
(  72.16,18.55 0 top
)  79.56,18.55 0 top
,  72.16,11.71 0 top
.  79.56,11.71 0 top
?  57.33,11.71 0 top
@  64.73,4.87 0 top
A  5.43,18.55 0 top
B  35.2,11.71 0 top
BATTERY  53.83,88.42 270 top
C  20.27,11.71 0 top
C1  41.65,81.97 135 bottom
C2  35.6,54.05 90 bottom
C3  34.17,54.05 90 bottom
C4  31.32,54.05 90 bottom
C5  31.23,93.6 0 bottom
C6  27.52,53.67 180 bottom
C7  34.85,51.77 0 bottom
C9  32.35,74.95 180 bottom
C10  45.88,91.22 180 bottom
C11  23.7,84.5 270 bottom
C12  34.9,86.33 180 bottom
C13  32.35,76.45 180 bottom
C14  32.83,80.67 90 bottom
C15  41.35,93.05 0 bottom
C16  23.7,87.25 270 bottom
C17  74.5,90.22 180 bottom
C18  32.75,54.05 90 bottom
C19  23,58.83 0 bottom
C20  25.02,62.85 90 bottom
C21  26.93,56.2 270 bottom
C22  27.52,52.17 0 bottom
C23  27.35,49.08 0 bottom
D  20.27,18.55 0 top
D1  22.8,64 90 bottom
D2  42.33,88.08 90 bottom
D4  27.02,58.83 180 bottom
E  20.27,25.39 0 top
F  27.68,18.55 0 top
FN-RIGHT  75.86,4.87 0 top
G  35.2,18.55 0 top
H  42.51,18.55 0 top
I  57.33,25.39 0 top
IC1  26.15,78.75 270 bottom
IC2  64.88,50.92 270 bottom
J  49.97,18.55 0 top
K  57.33,18.55 0 top
L  64.73,18.55 0 top
L1  23.75,68.2 0 bottom
L2  39.5,88.38 90 bottom
M  49.97,11.71 0 top
N  42.51,11.71 0 top
O  64.73,25.39 0 top
P  72.16,25.39 0 top
Q  5.43,25.39 0 top
Q1  45.8,48.8 90 bottom
Q3  77.65,57.95 0 bottom
Q4  27.7,93.53 45 bottom
R  27.68,25.39 0 top
R1  80.17,47 0 bottom
R2  32.77,66.67 90 bottom
R3  74.85,47 180 bottom
R4  59.35,51.52 90 bottom
R5  57.35,51.52 90 bottom
R6  34.8,66.67 90 bottom
R7  25.68,84.7 270 bottom
R8  45.95,92.92 0 bottom
R9  24.8,91.33 0 bottom
R10  27.68,84.7 270 bottom
R13  38.05,80.78 0 bottom
R14  38.05,78.75 0 bottom
R15  38.05,76.72 0 bottom
R16  38.05,74.72 180 bottom
R17  38.05,72.7 180 bottom
R18  39.23,60.12 180 bottom
R19  39.23,58.15 180 bottom
R20  39.23,56.17 180 bottom
R21  38.88,53.1 90 bottom
R22  40.85,53.1 90 bottom
R23  42.85,53.1 90 bottom
R24  42.75,48.7 90 bottom
R25  40.7,48.7 90 bottom
R26  26.02,87.5 180 bottom
R27  24.8,89.35 0 bottom
R36  26.98,62.92 270 bottom
R37  26.18,65.62 180 bottom
R38  28.7,56.1 90 bottom
S  12.86,18.55 0 top
SHIFT-RIGHT  53.62,4.87 0 top
SHILFT-LEFT  9.14,4.87 0 top
SPACE1  21.5,4.87 0 top
SPACE2  31.39,4.87 0 top
SPACE3  41.27,4.87 0 top
T  35.2,25.39 0 top
T2  36.45,92.12 180 bottom
U  49.97,25.39 0 top
U$1  30.55,88.42 90 bottom
U$2  27.35,69.5 0 bottom
U$3  23.95,54.88 270 bottom
U$4  68.25,65.08 90 bottom
U$5  77.25,51.02 270 bottom
U$6  34.42,60.73 0 bottom
U$7  77.15,32.75 0 bottom
U$9  74,94.7 180 bottom
U$10  23.88,50.67 180 bottom
U$11  76.55,44.55 180 top
V  27.68,11.71 0 top
W  12.86,25.39 0 top
X  12.86,11.71 0 top
X5  48,53.2 0 bottom
Y  42.51,25.39 0 top
Z  5.43,11.71 0 top

### Tracks (layer width: path | path; a pad name or v marks a point on that pad's centre or on a via)
+3V3  (via drill 0.9)  (1 unrouted)
  Top 0.406: v38.92,50.52 40.21,51.81 v40.21,65.21
  Bottom 0.254: X5.3 44.02,79.97 | C3.1 C2.1 36.33,53.3 36.7,53.67 U$6.1 | 44.08,77.5 43,77.5 42.45,78.05
  Bottom 0.305: X5.35 41.42,64 | X5.7 42.55,77.97 41.92,78.6 | 44.02,78.5 42.65,78.5 | X5.5 42.6,79 | X5.4 42.67,79.5 | 44.02,80 42.62,80 | 43.98,80.5 42.55,80.5
  Bottom 0.406: C2.1 C7.1
  Bottom 0.61: R2.2 R6.2 | R6.2 37.9,67.53 v40.21,65.21 41.42,64 | 37.2,81.92 R13.2 | R6.2 34.73,67.53 34.73,75.5 35.95,76.72 R15.2 | 31.4,78.92 31.57,78.75 | C14.1 32.83,78.9 32.67,78.75 | 34.3,78.88 34.17,78.75 | v38.92,50.52 36.85,50.52 C7.1 39.52,47.85 R25.1
  Bottom 1.016: IC1.2 31.22,78.75 31.57,78.75 32.67,78.75 34.17,78.75 R14.2
  pour Bottom (isolate 0.305): 36.8,75.88 44.6,75.88 44.6,80.55 42.1,80.55 40.3,82.35 37.23,82.35 36.8,81.92
+5V  (via drill 0.9)
  Top 0.61: U$11.P$4 75.25,43.25 75.25,45.67
  Top 1.016: v27.07,51.1 23.05,55.12 23,66.22 23,68.7 v24.2,69.9 v24.2,74.9 24.2,81.4 | v34.58,93.25 33.42,94.42 24.48,94.42 22.35,92.3 v22.35,89.45 22.35,83.25 24.2,81.4 | v47.8,60.48 47.8,75.35 41.75,81.4 | 41.75,81.4 24.2,81.4 | 75.25,51.08 75.25,79.38 70.15,84.47 44.83,84.47 41.75,81.4
  Top 1.27: 75.25,45.67 75.25,51.08
  Bottom 0.254: U$11.P$2 76.55,42.05 | X5.43 45.35,60 | R27.2 23.75,89.35 23.7,89.3 | v34.58,93.25 33.75,92.78 T2.E | U$1.13 32.8,90.42 33.08,90.7
  Bottom 0.406: 45.35,60 47.35,60 v47.8,60.48 | 23.7,89.38 23.7,89.3 | C13.1 C9.1
  Bottom 0.61: L1.1 U$2.3 24.62,68.2 v24.2,69.9 | 25.25,52.12 U$3.4 C6.1 | 25.25,52.12 U$10.4 | 25.25,52.12 26.62,52.12 C22.2 27.07,51.67 v27.07,51.1 | IC1.3 C13.1 | C16.1 23.7,89.1 R27.2
  Bottom 0.813: 29.27,76.41 IC1.3 27.76,74.9 v24.2,74.9
  Bottom 1.016: 23.7,89.3 22.98,89.3 22.61,89.66 | 22.61,89.66 22.52,89.75 22.52,92.53 23.7,93.7 26.29,93.7 Q4.2 | v22.35,89.45 22.27,89.33 22.61,89.66
  pour Top (isolate 0.254, no thermals): 73.4,43.98 73.41,41.96 arc91 73.94,41.4 76.88,41.4 77.12,41.75 77.12,44.55 75.9,44.73 75.6,44.95 75.6,45.58 74.9,45.58 74.9,44.33
  pour Bottom (isolate 0.305, no thermals): 31.73,90.17 35.65,90.15 36.25,90.75 36.3,91.05 36.3,94.67 32.45,94.62 31.73,93.9
+15V
  Bottom 0.61: D1.C C20.1 | C20.1 R36.2 | C20.1 25.02,59.12 D4.C C19.1
BAT  (via drill 0.9)
  Top 1.016: BATTERY.1 41.48,87.16 39.25,84.92 29.1,84.92 28.43,85.6 28.43,90.92 v29.5,92
  Bottom 0.254: 29.1,91.05 U$1.11
  Bottom 0.406: 29.1,92.15 29.1,93.51 Q4.3 | v29.5,92 29.1,92.15 | 29.1,92.15 29.1,91.05
BOOST
  Bottom 0.254: U$1.19 32.75,87.42 33.83,86.33 C12.1
CE0  (via drill 0.9)
  Top 0.406: U$11.P$24 47.35,43.27 47.35,51.08 v47.05,51.3
  Bottom 0.254: X5.38 45.15,62.5 45.42,62.23
  Bottom 0.406: 45.42,62.23 48.35,62.23 49.75,60.83 49.75,52.52 48.55,51.33 v47.05,51.3
COL0  (via drill 0.9)
  Top 0.254: 1.IN 5.73,33.63 v5.45,33.65 | v12.85,33.65 12.84,33.65 2.IN | 3.IN 20.02,33.63 v20.27,33.65 | 4.IN 27.42,33.63 v27.68,33.65 | 5.IN 34.97,33.63 v35.2,33.65 | 6.IN 42.27,33.63 v42.5,33.62 | 7.IN 49.67,33.63 v49.98,33.62 | 8.IN 57.18,33.63 v57.33,33.62 | 9.IN 64.52,33.63 v64.53,33.65
  Bottom 0.254: v12.85,33.65 v20.27,33.65 20.02,33.63 3.IN 20.29,33.65 v27.68,33.65 27.42,33.63 4.IN 27.7,33.65 v35.2,33.65 v42.5,33.62 42.27,33.63 6.IN 42.52,33.65 v49.98,33.62 49.7,33.6 v57.33,33.62 57.18,33.63 8.IN 57.34,33.65 v64.53,33.65 | 64.69,33.63 64.52,33.63 v64.53,33.65 | v64.53,33.65 64.55,33.63 9.IN 66.68,35.58 70.83,35.58 71.9,34.5 U$7.29
  Bottom 0.61: v5.45,33.65 v64.53,33.65
COL1  (via drill 0.9)
  Top 0.254: v12.82,25.38 W.IN | E.IN 20.3,24.99 20.3,25.05 | 27.55,25.39 R.IN 27.7,25.02 v27.7,25.4 | 27.55,25.39 v27.7,25.4 | T.IN 35.05,25.39 v35.2,25.38 | 20.1,25 v20.27,25.35 | v20.27,25.35 20.3,25.05 | 20.3,25.05 20.35,25 v20.27,25.35 | 27.55,25.39 27.6,25.34 27.6,25 v27.7,25.4
  Top 0.406: Y.IN v42.45,25.38 | U.IN 50,25.36 v49.98,25.4 | I.IN v57.33,25.38 | O.IN v64.75,25.38 64.78,25.35 | P.IN v72.17,25.4 | v72.75,36.08 77.15,36.08 79.83,33.4 79.83,27.68 v77.55,25.4
  Top 1.016: Q.IN 5.54,25.39 v5.45,25.38
  Bottom 0.254: v12.82,25.38 W.IN | T.IN 35.05,25.39 v35.2,25.38 | v72.75,36.08 73.83,35 U$7.30
  Bottom 0.406: v77.55,25.4 v72.17,25.4 72.12,25.38 v64.75,25.38 v57.33,25.38 57.12,25.38 v49.98,25.4 49.9,25.4 v42.45,25.38 v35.2,25.38 27.73,25.38 v27.7,25.4 27.56,25.4 27.51,25.35 v20.27,25.35 12.85,25.35 v12.82,25.38 v5.45,25.38
COL2  (via drill 0.9)
  Top 0.254: SHILFT-LEFT.IN 9.28,4.87 arc-90 v9.15,4.85 | v21.5,4.85 21.52,4.85 SPACE1.IN | SPACE2.IN 31.27,4.87 v31.45,4.85 | SPACE3.IN 41.23,4.87 v41.2,4.9 | SHIFT-RIGHT.IN 53.57,4.87 v53.55,4.85 | @.IN 64.67,4.87 v64.65,4.85 | FN-RIGHT.IN 75.72,4.87 v75.7,4.85
  Bottom 0.254: v75.7,4.85 v64.65,4.85 v53.55,4.85 41.25,4.85 v41.2,4.9 31.41,4.9 SPACE2.IN 31.43,4.87 v31.45,4.85 v21.5,4.85 | FN-RIGHT.IN 75.72,4.87 v75.7,4.85 | v75.7,4.85 83.3,12.45 83.3,38.15 81.25,40.2 76.53,40.2 74.9,38.58 U$7.31
  Bottom 0.61: v9.15,4.85 v75.7,4.85
COL3  (via drill 0.9)
  Top 0.254: Z.IN 5.25,11.7 v5.45,11.7 | v12.85,11.7 13.49,11.71 X.IN | C.IN 20.25,11.7 v20.2,11.7 | V.IN 27.66,11.7 v27.6,11.7 | B.IN 35.19,11.7 v35.05,11.7 | N.IN 42.49,11.7 v42.3,11.7 | M.IN 49.95,11.7 v49.7,11.7 | ?.IN v57.2,11.71 v57.2,11.7 | !.IN v64.55,11.71 v64.55,11.7 | ,.IN v72,11.71 v72,11.7 | ..IN v79.4,11.71 v79.4,11.7
  Bottom 0.254: v49.7,11.7 v49.69,11.71 49.15,11.71 | 49.15,11.71 N.IN 42.49,11.7 v42.3,11.7 v35.05,11.7 v35.04,11.71 V.IN 27.66,11.7 v27.6,11.7 v27.59,11.71 C.IN 20.25,11.7 v20.2,11.7 v12.85,11.7 | v57.2,11.7 49.15,11.7 49.15,11.71 | v64.55,11.7 v72,11.7 v79.4,11.7 | ..IN v79.41,11.71 v79.4,11.7 | v79.4,11.7 82.65,14.95 82.65,36.77 82.65,37.1 82.65,37.95 80.92,39.67 76.78,39.67 75.4,38.3 U$7.32
  Bottom 0.61: v64.55,11.7 v57.2,11.7 | v5.45,11.7 v79.4,11.7
COL4  (via drill 0.9)
  Top 0.254: ).IN v79.4,18.55 | v72.05,18.55 (.IN | L.IN v64.85,18.55 | K.IN v57.2,18.55 | J.IN v50.1,18.55 | H.IN v42.65,18.55 | G.IN v35.35,18.55 | F.IN v27.8,18.55 | D.IN v20.45,18.55 | S.IN v13.05,18.55 | A.IN v5.35,18.55
  Bottom 0.254: v13.05,18.55 v20.45,18.55 v27.8,18.55 v35.35,18.55 v42.65,18.55 v50.1,18.55 v57.2,18.55 v64.85,18.55 v72.05,18.55 v79.4,18.55 79.65,18.55 82.1,21 82.1,37.58 80.55,39.12 77,39.12 75.9,38.02 U$7.33
  Bottom 0.61: v5.35,18.55 v79.4,18.55
D/C  (via drill 0.9)
  Top 0.406: v49.38,50.05 50.3,49.12 50.3,46.02 49.88,45.6 49.88,43.28 U$11.P$22
  Bottom 0.254: X5.37 45.6,63
  Bottom 0.406: 45.6,63 48.83,63 50.62,61.2 50.62,51.3 v49.38,50.05 49.9,50.05
DE
  Bottom 0.305: R17.2 41.2,75 X5.13
DISPLAY_RESET  (via drill 0.9)
  Top 0.406: U$11.P$35 33.37,48.08 26.32,55.12 26.32,73.2 30.9,77.78 v41.08,77.78
  Bottom 0.305: R13.1 41.9,77.78 | X5.9 42.67,77 41.9,77.78 | 41.9,77.78 v41.08,77.78
FB
  Bottom 0.61: C20.2 25.23,63.8 R36.1 R37.2 27.35,65.95 U$2.2
GND  (via drill 0.6, 0.9)  (1 unrouted)
  Bottom 0.254: 44,65.5 45.73,65.5 45.9,65.67 45.9,66 | X5.50 44.05,53.5 v46.65,57.33 | X5.1 44.05,83.65 | U$1.16 30.82,88.92 | 30.82,88.92 30.55,88.92 v30.55,89.47 U$1.GND | U$1.1 30.82,85.92 30.82,88.92 | 45.9,70 49.5,70 | U$6.6 33.45,57.23 32.77,56.55 | U$7.1 79.88,35 | 79.88,35 79.88,35.05 | 79.88,35 79.88,33.5 U$7.4 | U$7.37 77.9,33.75 U$7.VIA1
  Bottom 0.305: 41.8,74 41.75,74.5 X5.14 45.95,74.5 45.9,74 | 41.8,74 41.8,73.5 | 41.8,73.5 41.8,73 | 41.8,73 41.8,72.5 | 41.8,72.5 41.8,72 | 41.8,72 41.8,71.5 | 41.8,71.5 41.8,71 | 41.8,71 41.8,70.5 | 41.8,70.5 41.8,70 | 41.8,70 41.8,69.5 | 41.8,68.5 41.8,68 | 41.8,68 41.8,67.5 | 41.8,67.5 41.8,67 | 41.8,67 41.8,66.5 | 41.8,66.5 41.8,66 | 41.8,66 42.3,65.5 44,65.5 X5.32 | 41.8,66 X5.31 45.9,66 45.9,66.5 | 41.8,66.5 X5.30 45.9,66.5 | 41.8,67 X5.29 45.9,67 | 41.8,67.5 X5.28 45.9,67.5 | 41.8,68 X5.27 45.9,68 | 41.8,68.5 X5.26 45.9,68.5 | 41.8,69.5 X5.24 45.9,69.5 | 41.8,69.5 41.8,69 | 41.8,69 X5.25 45.9,69 | 41.8,69 41.8,68.5 | 41.8,70 X5.23 45.9,70 | 41.8,70.5 X5.22 45.9,70.5 | 41.8,71 X5.21 45.9,71 | 41.8,71.5 X5.20 45.9,71.5 | 41.8,72 X5.19 45.9,72 | 41.8,72.5 X5.18 45.9,72.5 | 41.8,73 X5.17 45.9,73 | 41.8,74 X5.15 45.9,74 | 41.8,73.5 X5.16 45.9,73.5 | 45.9,74 45.9,73.5 | 45.9,73.5 45.9,73 | 45.9,73 45.9,72.5 | 45.9,72.5 45.9,72 | 45.9,72 45.9,71.5 | 45.9,71.5 45.9,71 | 45.9,71 45.9,70.5 | 45.9,70.5 45.9,70 | 45.9,70 45.9,69.5 | 45.9,69.5 45.9,69 | 45.9,69 45.9,68.5 | 45.9,68.5 45.9,68 | 45.9,68 45.9,67.5 | 45.9,67.5 45.9,67 | 45.9,67 45.9,66.5 | U$6.16 36.7,64.5 36.9,64.7 34.98,64.7 34.75,64.47 U$6.13 | U$6.14 U$6.13 | U$6.13 34.75,62.55 | U$6.14 35.4,62.85 34.65,62.1 | U$6.14 35.4,64.62
  Bottom 1.27: 30.52,86.25 30.52,85.25
  other vias: 30.55,87.38 30.55,90.55 30.55,86.28 65.47,47.33 67.47,39.08 30.8,72.47
  pour Bottom (isolate 0.305, rank 6): 0,39 0,3 arc90 3,0 82,0 arc90 84.92,3.1 84.92,92.7 arc90 81.6,96 21.41,96.2 arc90 20.5,95.04 20.5,40 1,40 arc90
  pour Top (isolate 0.38, rank 6): 0,39 0,3 arc90 3,0 82,0 arc90 85.12,3.23 85.12,92.83 arc90 81.6,96 21.5,96 arc90 20.5,95 20.5,40 1,40 arc90
H_SYNC
  Bottom 0.305: R15.1 39.62,76 X5.11
HVOUT
  Bottom 0.254: U$1.18 33,87.92 33.77,87.2 35.1,87.2 37.12,88.62 T2.C
  pour Bottom (isolate 0.254, rank 2, no thermals): 31.65,87.7 32.8,87.7 33.8,86.7 35.83,86.7 39.95,89.6 40.8,89.6 41.23,90.03 41.23,94.65 37.27,94.65 36.08,94.3 36.05,89.65 34.52,88.33 31.65,88.33
HVPR  (via drill 0.9)
  Top 0.406: v37.17,93.25 36.15,92.03 33.75,92.03 32.5,93.28 27.68,93.28 25.55,91.15 v25.55,89.55
  Bottom 0.254: U$1.7 26.15,88.92 R27.1
  Bottom 0.406: T2.B v37.17,93.25 37.65,93.22 | R27.1 v25.55,89.55
ID_SC  (via drill 0.9)
  Top 0.406: U$11.P$28 40.8,39.28 v40.8,37.83
  Bottom 0.406: R4.1 59.84,50.29 IC2.6 62.13,50.3 62.75,50.3 63.35,49.7 63.35,46.9 62.55,46.1 62.55,40 61.67,39.12 46.88,39.12 44.92,37.17 41.45,37.17 v40.8,37.83
ID_SD  (via drill 0.9)
  Top 0.406: U$11.P$27 44.8,43.27 44.8,40.6 v44.8,39.4
  Bottom 0.406: 60.02,49 59.92,49 | 60.02,49 60.02,40.62 59.27,39.88 45.27,39.88 v44.8,39.4 | 60.02,49 61.52,49 IC2.5
  Bottom 0.61: R5.1 57.35,49.83 58.16,49.02 IC2.5
IN  (via drill 0.9)
  Top 0.406: v35.65,89.15 35.27,89.45 32.83,89.45 32,90.3 v32,91.95
  Bottom 0.254: 32,91.12 U$1.12 | U$1.15 35.55,89.4 v35.65,89.15
  Bottom 0.406: 72.7,90.92 U$9.1_+5V | v32,91.95 32,91.8
  Bottom 0.61: C5.1 32,91.12 | C17.1 72.62,90.65 72.7,90.72
  Bottom 0.813: C5.1 32,91.8 32,94.28 32.42,94.67 66.95,94.67 69.12,92.5 69.12,91 69.97,90.15 72.47,90.15 72.7,90.38 72.7,90.72 72.7,90.92
IN_1
  Bottom 0.61: U$3.1 25.77,55.45 C21.2
INT_KB  (via drill 0.9)
  Top 0.406: v53.7,22.43 53.7,36.2 58.77,41.27 U$11.P$16
  Bottom 0.254: v53.7,22.43 54.58,23.3 78.55,23.3 78.9,23.65 U$7.12
INT_RTC  (via drill 0.9)
  Top 0.406: v68.95,47.1 68.95,44.57 U$11.P$7
  Bottom 0.406: U$5.7 70.61,51.66 69.88,50.92 69.88,47.58 69.4,47.1 v68.95,47.1
INT_TOUCH  (via drill 0.9)
  Top 0.406: v31.98,60.42 32,52.1 38.48,45.62 U$11.P$31
  Bottom 0.305: U$6.10 32.8,61.25 v31.98,60.42
LEDK1
  Bottom 0.305: X5.44 40.7,59.5 R18.2
LEDK2
  Bottom 0.305: X5.45 40.92,59 R19.2
LEDK3
  Bottom 0.305: X5.46 41.98,58.5 41.15,57.67 41.15,56.9 40.42,56.17 R20.2
LEDK4
  Bottom 0.305: X5.47 42.4,58 41.8,57.4 41.8,55.75 40.98,54.92 39.85,54.92 R21.2
LEDK5
  Bottom 0.254: 40.7,54 R22.2
  Bottom 0.305: X5.48 42.75,57.5 42.38,57.12 42.38,55.48 R22.2
LEDK6
  Bottom 0.305: X5.49 43.2,57 43,56.8 43,54.1 R23.2
LX
  Bottom 0.61: D1.A L1.2 22.8,72 23.45,72.65 27.52,72.65 28.3,71.88 U$2.5
MISO  (via drill 0.9)
  Top 0.406: U$11.P$21 51.15,47.95 v53.92,50.73
  Bottom 0.254: X5.33 45.95,65 46.38,65.35
  Bottom 0.406: 46.38,65.35 49.8,65.35 53.1,62.02 53.27,61.85 53.27,53.05 53.92,52.48 v53.92,50.73
MOSI  (via drill 0.9)
  Top 0.61: v53.6,48.12 53.69,48.03 U$11.P$19
  Bottom 0.254: X5.34 46.42,64.5
  Bottom 0.406: 46.42,64.5 49.5,64.5 52.42,61.58 52.42,49.3 v53.6,48.12
N$3
  Bottom 0.254: U$1.9 27.1,89.92 R9.1
N$4
  Bottom 0.254: R10.1 28.35,86.22 28.35,86.72 28.55,86.92 U$1.3
N$5  (via drill 0.9)
  Top 0.61: v34.27,90.78 38.38,90.78 40.38,92.9 v48.27,92.92
  Bottom 0.254: U$1.14 33.67,89.92 34.38,90.62 v34.27,90.78
  Bottom 0.406: v48.27,92.92 R8.1
N$6
  Bottom 0.254: R7.1 26.6,86.47 27.6,86.47 27.82,86.7 27.82,87.17 28.07,87.42 U$1.4
N$7  (via drill 0.9)
  Top 0.406: v34.17,88.22 34.17,88 34.55,87.58 37.67,87.58 40.17,90.08 v46.62,90.08
  Bottom 0.254: U$1.17 32.65,88.42 32.88,88.65 33.75,88.65 v34.17,88.22
  Bottom 0.406: v46.62,90.08 C10.2
N$8
  Bottom 0.406: C11.2 23.8,83.85 R7.2
N$11
  Bottom 0.406: Q3.1 80.44,52.93 U$5.1
N$12
  Bottom 0.61: Q1.2 44.8,51.4 43.95,52.25 R23.1 R22.1 R21.1 37.9,52.25 37.62,52.67 37.62,55.4 R20.1 R19.1 R18.1
N$13
  Bottom 0.406: U$5.2 81.23,51.66 81.97,52.4 81.97,57.95 Q3.4
N$16
  Bottom 0.61: D4.A R38.2 C21.1
N$20
  Bottom 0.61: Q1.1 R24.1
N$21
  Bottom 0.254: U$1.6 26.1,88.42 R26.1
N$27
  Bottom 0.254: R26.2 27.3,87.92 U$1.5
N$33
  Bottom 0.254: U$1.10 28.12,90.42 27.66,90.91 Q4.1
OUT1_IN2
  Bottom 0.406: U$3.3 22.8,54.08
  Bottom 0.61: 22.8,54.08 U$10.1
OUT2
  Bottom 0.61: U$10.3 25.27,49.08 C23.2
P_CLK
  Bottom 0.305: R16.2 39.67,75.5 X5.12
PWM  (via drill 0.9)  (1 unrouted)
  Top 0.61: U$11.P$29 41,48.77 v41.77,49.55
  Bottom 0.61: R25.2 R24.2
RANDOM  (via drill 0.9)
  Top 0.406: v29.1,48.83 30.83,47.09 U$11.P$37
  Bottom 0.406: C23.1 28.85,49.08 v29.1,48.83
ROW0  (via drill 0.9)
  Top 0.254: 6.85,10.35 arc90 7.4,10.9 7.4,11.65 arc90 Z.OUT Z.OUT arc-90 5.4,13.64 | 8.2,6.75 9.12,6.75 SHILFT-LEFT.OUT | 1.OUT 1.OUT arc90 3.5,33.6 arc90 5.45,31.65 7.55,31.65 v7.6,31.6 | 5.45,27.3 arc-90 Q.OUT 5.34,27.29 arc90 3.45,25.4 3.45,25.3 arc90 5.4,23.35 | 5.4,20.48 arc90 A.OUT 5.3,20.45 arc90 3.4,18.55 3.4,18.4 arc90 5.4,16.4
  Top 0.61: 5.45,31.65 5.43,31.64 Q.OUT | 5.4,23.35 5.43,23.32 A.OUT | 5.4,16.4 5.43,16.36 Z.OUT | 8.2,6.75 6.85,8.1 6.85,10.35
  Bottom 0.254: v7.6,31.6 12.6,26.6 76.33,26.6 77.4,27.68 U$7.15
ROW1  (via drill 0.9)
  Top 0.254: 2.OUT 12.73,35.53 arc90 10.85,33.65 10.85,33.55 arc90 12.85,31.55 14.75,31.55 v14.85,31.45 | W.OUT arc90 W.OUT 12.74,27.29 arc90 10.85,25.4 10.85,25.35 arc90 12.9,23.3 | 12.9,20.5 arc-90 S.OUT 12.75,20.45 arc90 10.85,18.55 10.85,18.45 arc90 12.85,16.45 | X.OUT arc90 X.OUT
  Top 0.61: 12.9,23.3 12.86,23.25 S.OUT | 12.85,31.55 12.86,31.55 W.OUT | 12.85,16.45 12.86,16.45 X.OUT
  Bottom 0.254: v14.85,31.45 19.25,27.05 75.95,27.05 76.9,28 U$7.16
ROW2  (via drill 0.9)
  Top 0.254: 20.25,9.65 arc90 22.2,11.6 22.2,11.75 arc90 20.34,13.61 C.OUT arc90 20.3,13.64 | 20.3,16.55 arc-90 18.3,18.55 arc-90 20.2,20.45 D.OUT arc-90 20.25,20.46 | 20.25,23.3 arc-90 18.25,25.3 18.25,25.4 arc-90 20.14,27.29 E.OUT arc-90 20.25,27.3 | 3.OUT 20.18,35.53 arc90 18.3,33.65 18.3,33.5 arc90 20.25,31.55 v22.45,31.55
  Top 0.61: 20.25,31.55 20.27,31.54 E.OUT | 20.25,23.3 20.27,23.29 D.OUT | 20.3,16.55 20.27,16.52 C.OUT | SPACE1.OUT 20.25,8.02 20.25,9.65
  Bottom 0.254: v22.45,31.55 26.5,27.5 75.6,27.5 76.4,28.3 U$7.17
ROW3  (via drill 0.9)
  Top 0.254: 4.OUT 27.53,35.53 arc90 25.65,33.65 arc90 27.7,31.6 27.7,31.35 27.95,31.6 v29.85,31.6 | 27.7,27.32 arc-90 R.OUT 27.59,27.29 arc90 25.7,25.4 25.7,25.2 arc90 27.65,23.25 | 27.65,20.48 arc90 F.OUT 27.6,20.45 arc90 25.7,18.55 25.7,18.45 arc90 27.65,16.5 | 27.65,13.63 arc90 V.OUT 27.79,13.61 arc-90 29.7,11.7 29.7,11.05 arc-90 29,10.35 | 30.55,6.75 31.36,6.75 SPACE2.OUT
  Top 0.61: 27.7,31.35 27.68,31.32 R.OUT | 27.65,16.5 27.68,16.48 V.OUT | 27.65,23.25 27.68,23.23 F.OUT | 30.55,6.75 29,8.3 29,10.35
  Bottom 0.254: v29.85,31.6 33.5,27.95 75.25,27.95 75.9,28.6 U$7.18
ROW4  (via drill 0.9)
  Top 0.254: 35.2,16.5 arc-90 33.25,18.45 33.25,18.55 arc-90 35.15,20.45 G.OUT arc90 G.OUT | B.OUT arc-90 B.OUT | 35.2,23.35 arc-90 33.3,25.25 33.3,25.4 arc-90 T.OUT T.OUT arc90 T.OUT | 5.OUT 35.03,35.53 arc90 33.15,33.65 33.15,33.55 arc90 35.2,31.5 35.35,31.65 v37.3,31.65
  Top 0.61: 35.2,31.5 T.OUT | 35.2,23.35 35.2,23.34 G.OUT | 35.2,16.5 B.OUT
  Bottom 0.254: v37.3,31.65 40.55,28.4 74.92,28.4 75.4,28.88 U$7.19
ROW5  (via drill 0.9)
  Top 0.254: 6.OUT 42.48,35.53 arc90 40.55,33.6 40.55,33.45 arc90 42.5,31.5 42.6,31.6 v44.75,31.6 | Y.OUT arc90 Y.OUT 42.49,27.29 arc90 40.6,25.4 40.6,25.3 arc90 42.5,23.4 | H.OUT arc90 H.OUT 42.4,20.45 arc90 40.45,18.5 40.45,18.45 arc90 42.5,16.4 | N.OUT arc90 N.OUT 42.41,13.61 arc90 40.5,11.7 40.5,11.2 arc90 41.75,9.95
  Top 0.61: 42.5,31.5 42.51,31.5 Y.OUT | 42.5,23.4 42.51,23.39 H.OUT | 42.5,16.4 42.51,16.39 N.OUT | SPACE3.OUT 41.27,9.46 41.75,9.95
  Bottom 0.254: v44.75,31.6 47.5,28.85 74.6,28.85 74.9,29.15 U$7.20
ROW6  (via drill 0.9)
  Top 0.254: 51.35,10.25 arc90 52,10.9 52,11.7 arc90 50.09,13.61 M.OUT arc-90 49.95,13.62 | 52.65,6.75 53.6,6.75 SHIFT-RIGHT.OUT | 49.95,16.5 arc-90 47.9,18.55 47.9,18.6 arc-90 49.75,20.45 J.OUT arc-90 49.95,20.46 | 49.95,23.4 arc-90 48,25.35 48,25.4 arc-90 49.89,27.29 U.OUT arc90 50,27.32 | 7.OUT 49.93,35.53 arc90 48,33.6 48,33.5 arc90 50,31.5 50.45,31.95 v51.38,31
  Top 0.61: 50,31.5 49.97,31.46 U.OUT | 49.95,23.4 49.97,23.39 J.OUT | 49.95,16.5 49.97,16.48 M.OUT | 52.65,6.75 51.35,8.05 51.35,10.25
  Bottom 0.254: U$7.21 51.88,30.5 v51.38,31
ROW7  (via drill 0.9)
  Top 0.254: 8.OUT 57.23,35.53 arc90 55.3,33.6 55.3,33.5 arc90 57.3,31.5 57.8,31.5 58.4,32.1 v59.1,32.1 | 57.3,27.32 arc90 I.OUT 57.19,27.29 arc90 55.3,25.4 arc90 57.35,23.35 | 57.35,20.48 arc-90 K.OUT 57.3,20.45 arc90 55.4,18.55 55.4,18.35 arc90 57.3,16.45 | 57.3,13.63 arc90 ?.OUT
  Top 0.61: 57.3,31.5 57.33,31.48 I.OUT | 57.35,23.35 57.33,23.32 K.OUT | 57.3,13.63 57.3,16.45
  Bottom 0.254: v59.1,32.1 59.6,31.45 60.05,31 U$7.22
ROW8  (via drill 0.9)
  Top 0.254: 64.75,9.65 arc-90 62.7,11.7 arc-90 64.61,13.61 !.OUT arc-90 64.7,13.64 | 64.75,6.79 arc-90 @.OUT | 64.7,16.5 arc-90 62.75,18.45 62.75,18.55 arc-90 64.65,20.45 L.OUT arc90 64.75,20.46 | 64.75,23.25 arc-90 62.7,25.3 62.7,25.35 arc-90 64.64,27.29 O.OUT arc90 64.75,27.3 | 9.OUT 64.63,35.53 arc90 62.7,33.6 62.7,33.55 arc90 64.75,31.5 65.35,31.5 65.95,32.3 v66.35,32.7
  Top 0.61: 64.7,16.5 64.73,16.46 !.OUT | 64.75,23.25 64.73,23.23 L.OUT | 64.75,31.5 64.73,31.48 O.OUT | 64.75,6.79 64.75,9.65
  Bottom 0.254: v66.35,32.7 67.55,31.5 U$7.23
ROW9  (via drill 0.9)
  Top 0.254: 72.2,16.5 arc-90 70.2,18.5 70.2,18.55 arc-90 72.1,20.45 (.OUT arc-90 (.OUT | 72.2,13.65 arc-90 ,.OUT 72.34,13.61 arc-90 74.2,11.75 74.2,11.05 arc-90 73.45,10.3 | P.OUT 72.04,27.29 arc90 70.15,25.4 70.15,25.35 arc90 72.15,23.35 72.16,23.34 | 75,6.8 75.83,6.8 FN-RIGHT.OUT
  Top 0.406: v69.67,32.58 72.16,30.09 P.OUT
  Top 0.61: 72.16,23.34 (.OUT | 72.2,16.5 72.16,16.45 ,.OUT | 75,6.8 73.45,8.35 73.45,10.3
  Bottom 0.254: U$7.24 70.28,32 v69.67,32.58
ROW10  (via drill 0.9)
  Top 0.254: ).OUT ).OUT arc90 77.65,18.55 77.65,18.5 arc90 79.55,16.6
  Top 0.406: 79.55,20.46 arc90 ).OUT 75.9,24.11 75.9,29.9 v72.3,33.5
  Top 0.61: 79.55,13.62 79.55,16.6 | 79.55,20.46 arc90 ).OUT
  Bottom 0.254: v72.3,33.5 73.3,32.5 U$7.25
SCK  (via drill 0.9)
  Top 0.406: v48.88,47.3 48.61,47.03 U$11.P$23
  Bottom 0.254: X5.36 45.15,63.5 45.33,63.67
  Bottom 0.406: 45.33,63.67 49.3,63.67 51.48,61.5 51.48,49.9 v48.88,47.3
SCL_3V3  (via drill 0.9)
  Top 0.406: U$11.P$5 71.47,49.02 v71.46,49.86 | v61.08,36.17 v61.08,22.18 | 35.6,65.92 v35.6,65.83 34.17,64.4 34.17,52.3 39.73,46.75 39.73,40.2 v37.15,37.62 37.17,37.65
  Bottom 0.254: 71.45,44.57 U$11.P$5 | v61.08,22.18 61.7,22.8 79.1,22.8 79.4,23.1 U$7.11
  Bottom 0.305: U$6.12 34.1,65.12 R6.1
  Bottom 0.406: 61.33,36.42 68.15,36.42 70.2,38.48 70.2,45.75 71.47,47.02 71.47,49.02 v71.46,49.86 72.7,49.88 73.22,50.39 U$5.6 75.96,50.39 76.53,49.85 78.2,48.17 80.38,48.17 81.03,47.52 R1.1 | 61.33,36.42 v61.08,36.17 | 61.33,36.42 48.8,36.42 48,35.62 39.15,35.62 v37.15,37.62 | v35.6,65.83 R6.1
SDA_3V3  (via drill 0.9)
  Top 0.406: v68.4,21.62 68.4,36.17 72.72,40.5 72.72,43.27 U$11.P$3 73.92,44.63 73.92,46.85 v73.42,47.35 73.42,50.85 72.08,52.2 55.55,52.2 53.4,54.35 45.58,54.35 43.48,56.45 43.48,66.25 40.5,69.22 v32.7,69.22
  Bottom 0.254: v68.4,21.62 79.28,21.62 80.15,22.5 U$7.10
  Bottom 0.305: U$6.11 33.45,65.15 R2.1
  Bottom 0.406: 73.95,44.61 U$11.P$3 | U$5.5 74.01,48.48 74.01,47.08 | R3.1 74,47.06 74.01,47.08 | 74.01,47.08 73.7,47.08 v73.42,47.35 | 32.75,65.85 R2.1 32.08,65.83 31.57,66.33 31.57,68.58 32.23,69.22 v32.7,69.22
STEPUP_ENABLE  (via drill 0.9)
  Top 0.406: v29.18,62.92 29.18,53.6 35.91,46.87 U$11.P$33
  Bottom 0.61: U$2.1 28.3,63.8 v29.18,62.92
SW
  Bottom 0.254: U$1.20 32.55,86.92 32.77,86.7 32.77,85.8 33.1,85.47 35.17,85.47 35.65,85.95 C12.2
  Bottom 1.016: L2.1 D2.C
  pour Bottom: 31.73,87.53 32.9,87.5 33.65,86.83 36.02,86.75 37.83,87.85 42.75,87.92 43.52,87.05 43.52,85.25 42.85,84.58 32.35,84.58 31.77,85.15
TOUCH_X+  (via drill 0.9)
  Top 0.406: v36.73,60 36.73,62.6 v37.98,63.85
  Bottom 0.254: X5.39 42.83,62 41.88,62.95 38.88,62.95 v37.98,63.85 | C2.2 36.05,55.25 U$6.2 36.05,59.35 v36.73,60
TOUCH_X-
  Bottom 0.254: X5.41 42.2,61 41.35,61.85 36.17,61.85 34.75,60.42 U$6.4 34.75,56.8 C18.2
TOUCH_Y+
  Bottom 0.254: X5.42 41.85,60.5 41,61.35 36.5,61.35 35.4,60.25 U$6.3 35.4,56.4 34.17,55.17 C3.2
TOUCH_Y-
  Bottom 0.254: X5.40 42.5,61.5 41.65,62.35 35.9,62.35 34.1,60.55 U$6.5 34.1,56.92 33.02,55.85 31.75,55.85 31.32,55.42 C4.2
V+  (via drill 0.9)
  Top 0.61: U$11.P$17 56.23,47.2 v56.12,47.3
  Bottom 0.406: U$5.8 72.95,52.92 71.12,54.75 64.04,54.75 62.12,52.83 IC2.8 59.91,52.83 R4.2 R5.2 56.42,52.38 56.12,52.08 v56.12,47.3
V_SYNC
  Bottom 0.305: X5.10 40.2,76.5 39.88,76.83 39.88,77.78 R14.1
VBAT+
  Bottom 0.406: U$5.3 78.44,50.39 77.92,50.9 77.92,53.45 76.88,54.5 73.65,54.5 71.7,56.45 69.22,56.45 U$4.+
VCC  (via drill 0.9)
  Top 0.406: v77.28,47 76.55,46.27 U$11.P$1 77.8,44.55 79.42,42.92 79.42,38.15 v78.7,37.42
  Bottom 0.254: U$7.38 78.4,37.25 v78.7,37.42 78.9,37.25 U$7.39
  Bottom 0.406: R3.2 v77.28,47 R1.2

### Text on the board
bNames: TCA8424